# Altium project Sampler_ver.0.0.PrjPcb
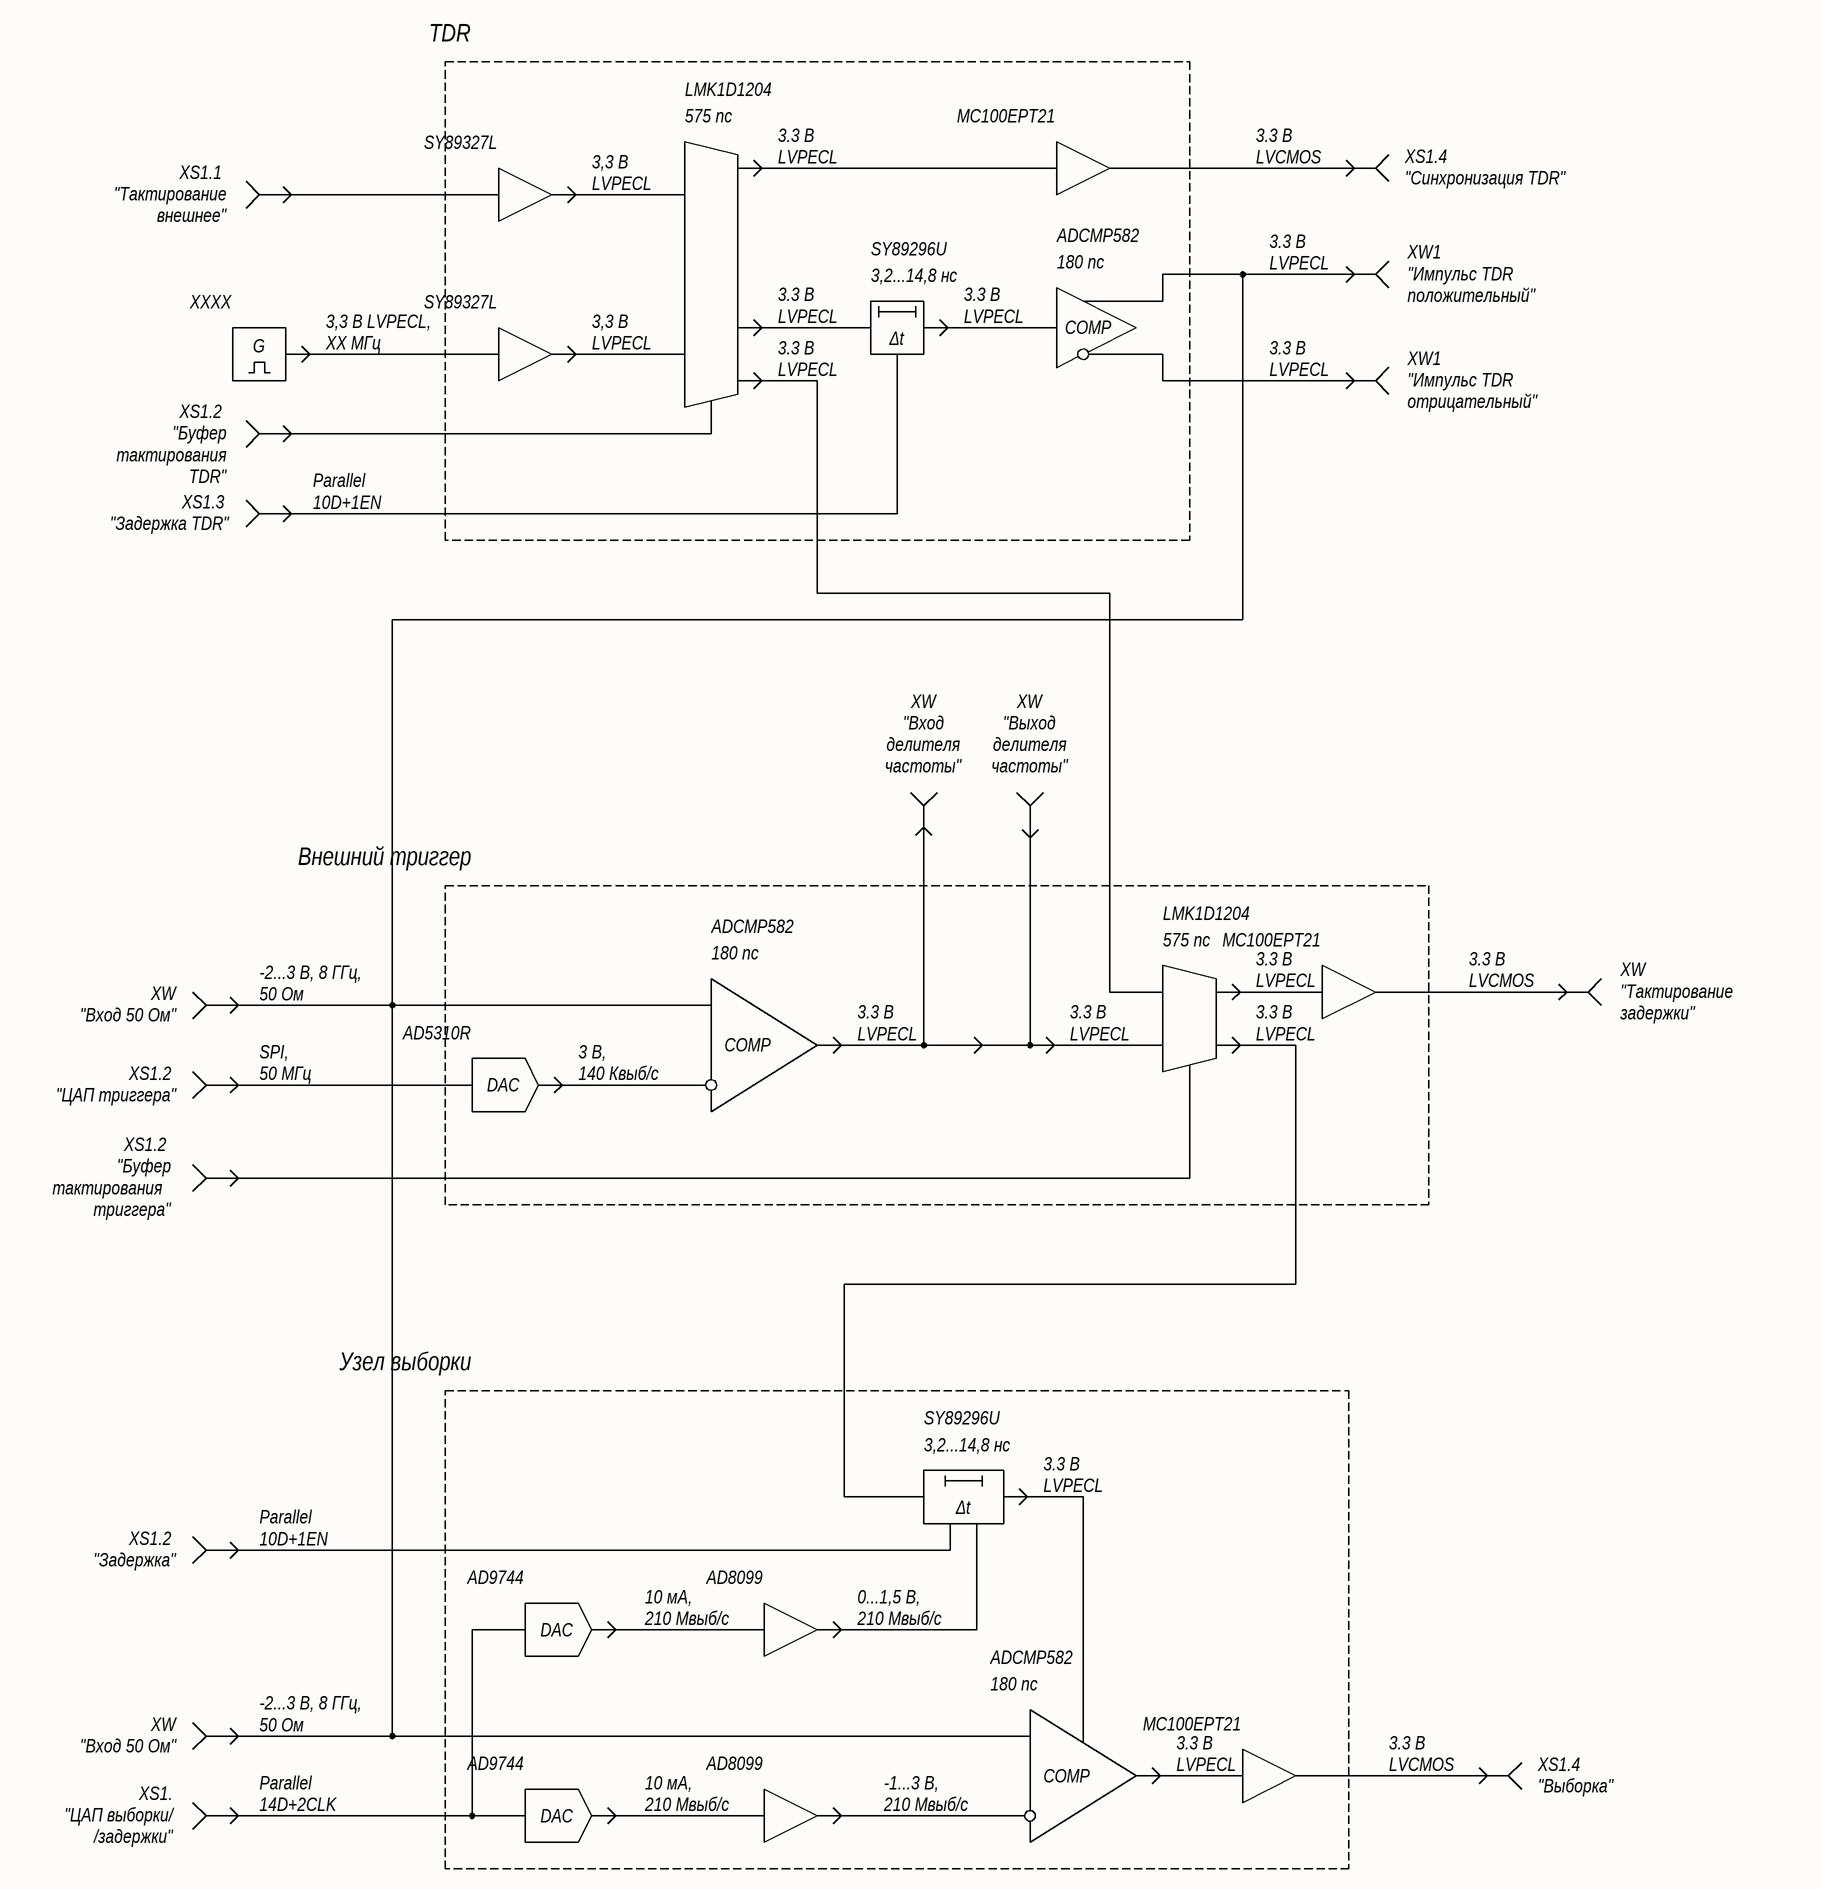
[diagram p0: Э2.SchDoc]
7 sheets, 253 parts. Net scope: global (net labels, ports and power ports of the same name join across sheets).
Board file: Sampler_ver.0.0.PcbDoc
Sheets:
  Э2.SchDoc
  Э3-1 УВ ЦАП.SchDoc
  Э3-2 УВ Компаратор.SchDoc
  Э3-3 Внешний триггер.SchDoc
  Э3-4 TDR Делитель.SchDoc
  Э3-5 TDR Генератор.SchDoc
  Э3-6 Электропитание.SchDoc

## Sheet Э2.SchDoc
size 594 x 420 mm; Address1: Address1; Address2: Address2; Address3: Address3; Address4: Address4; SheetNumber: 1; SheetTotal: 7; DocumentType: Схема электрическая принципиальная

### Notes on the sheet
- TDR
- LMK1D1204
- SY89327L
- 575 пс
- 3.3 В
  LVPECL
- MC100EPT21
- 3.3 В
  LVCMOS
- XS1.1
  "Тактирование
  внешнее"
- 3,3 В
  LVPECL
- ADCMP582
- XS1.4
  "Синхронизация TDR"
- XXXX
- 3,2...14,8 нс
- SY89296U
- 180 пс
- XW1
  "Импульс TDR
  положительный"
- G
- 3,3 В LVPECL,
  XX МГц
- Δt
- COMP
- XW1
  "Импульс TDR
  отрицательный"
- XS1.2
  "Буфер
  тактирования TDR"
- Parallel
  10D+1EN
- XS1.3
  "Задержка TDR"
- XW
  "Вход
  делителя
  частоты"
- XW
  "Выход
  делителя
  частоты"
- Внешний триггер
- XW
  "Вход 50 Ом"
- -2...3 В, 8 ГГц,
  50 Ом
- AD5310R
- XW
  "Тактирование
  задержки"
- XS1.2
  "ЦАП триггера"
- SPI,
  50 МГц
- DAC
- 3 В,
  140 Квыб/с
- XS1.2
  "Буфер
  тактирования
  триггера"
- Узел выборки
- XS1.2
  "Задержка"
- AD9744
- AD8099
- 10 мА,
  210 Мвыб/с
- 0...1,5 В,
  210 Мвыб/с
- XS1.4
  "Выборка"
- XS1.
  "ЦАП выборки/
  /задержки"
- Parallel
  14D+2CLK
- -1...3 В,
  210 Мвыб/с
- Перв. примен.
- Справ. №
- Подп. и дата
- Инв. № дубл.
- Взам. инв. №
- Разраб.
- Изм.
- Лист
- № докум.
- Подп.
- Дата
- Лит.
- Масса
- Масштаб
- Пров.
- Т.контр.
- Листов
- Инв. № подл.
- Утв.
- Н.контр.
- 2.106-A2
- Копировал
- Формат А2

## Sheet Э3-1 УВ ЦАП.SchDoc
size 594 x 420 mm; Address1: Address1; Address2: Address2; Address3: Address3; Address4: Address4; SheetNumber: 2; SheetTotal: 7; DocumentType: Схема электрическая принципиальная
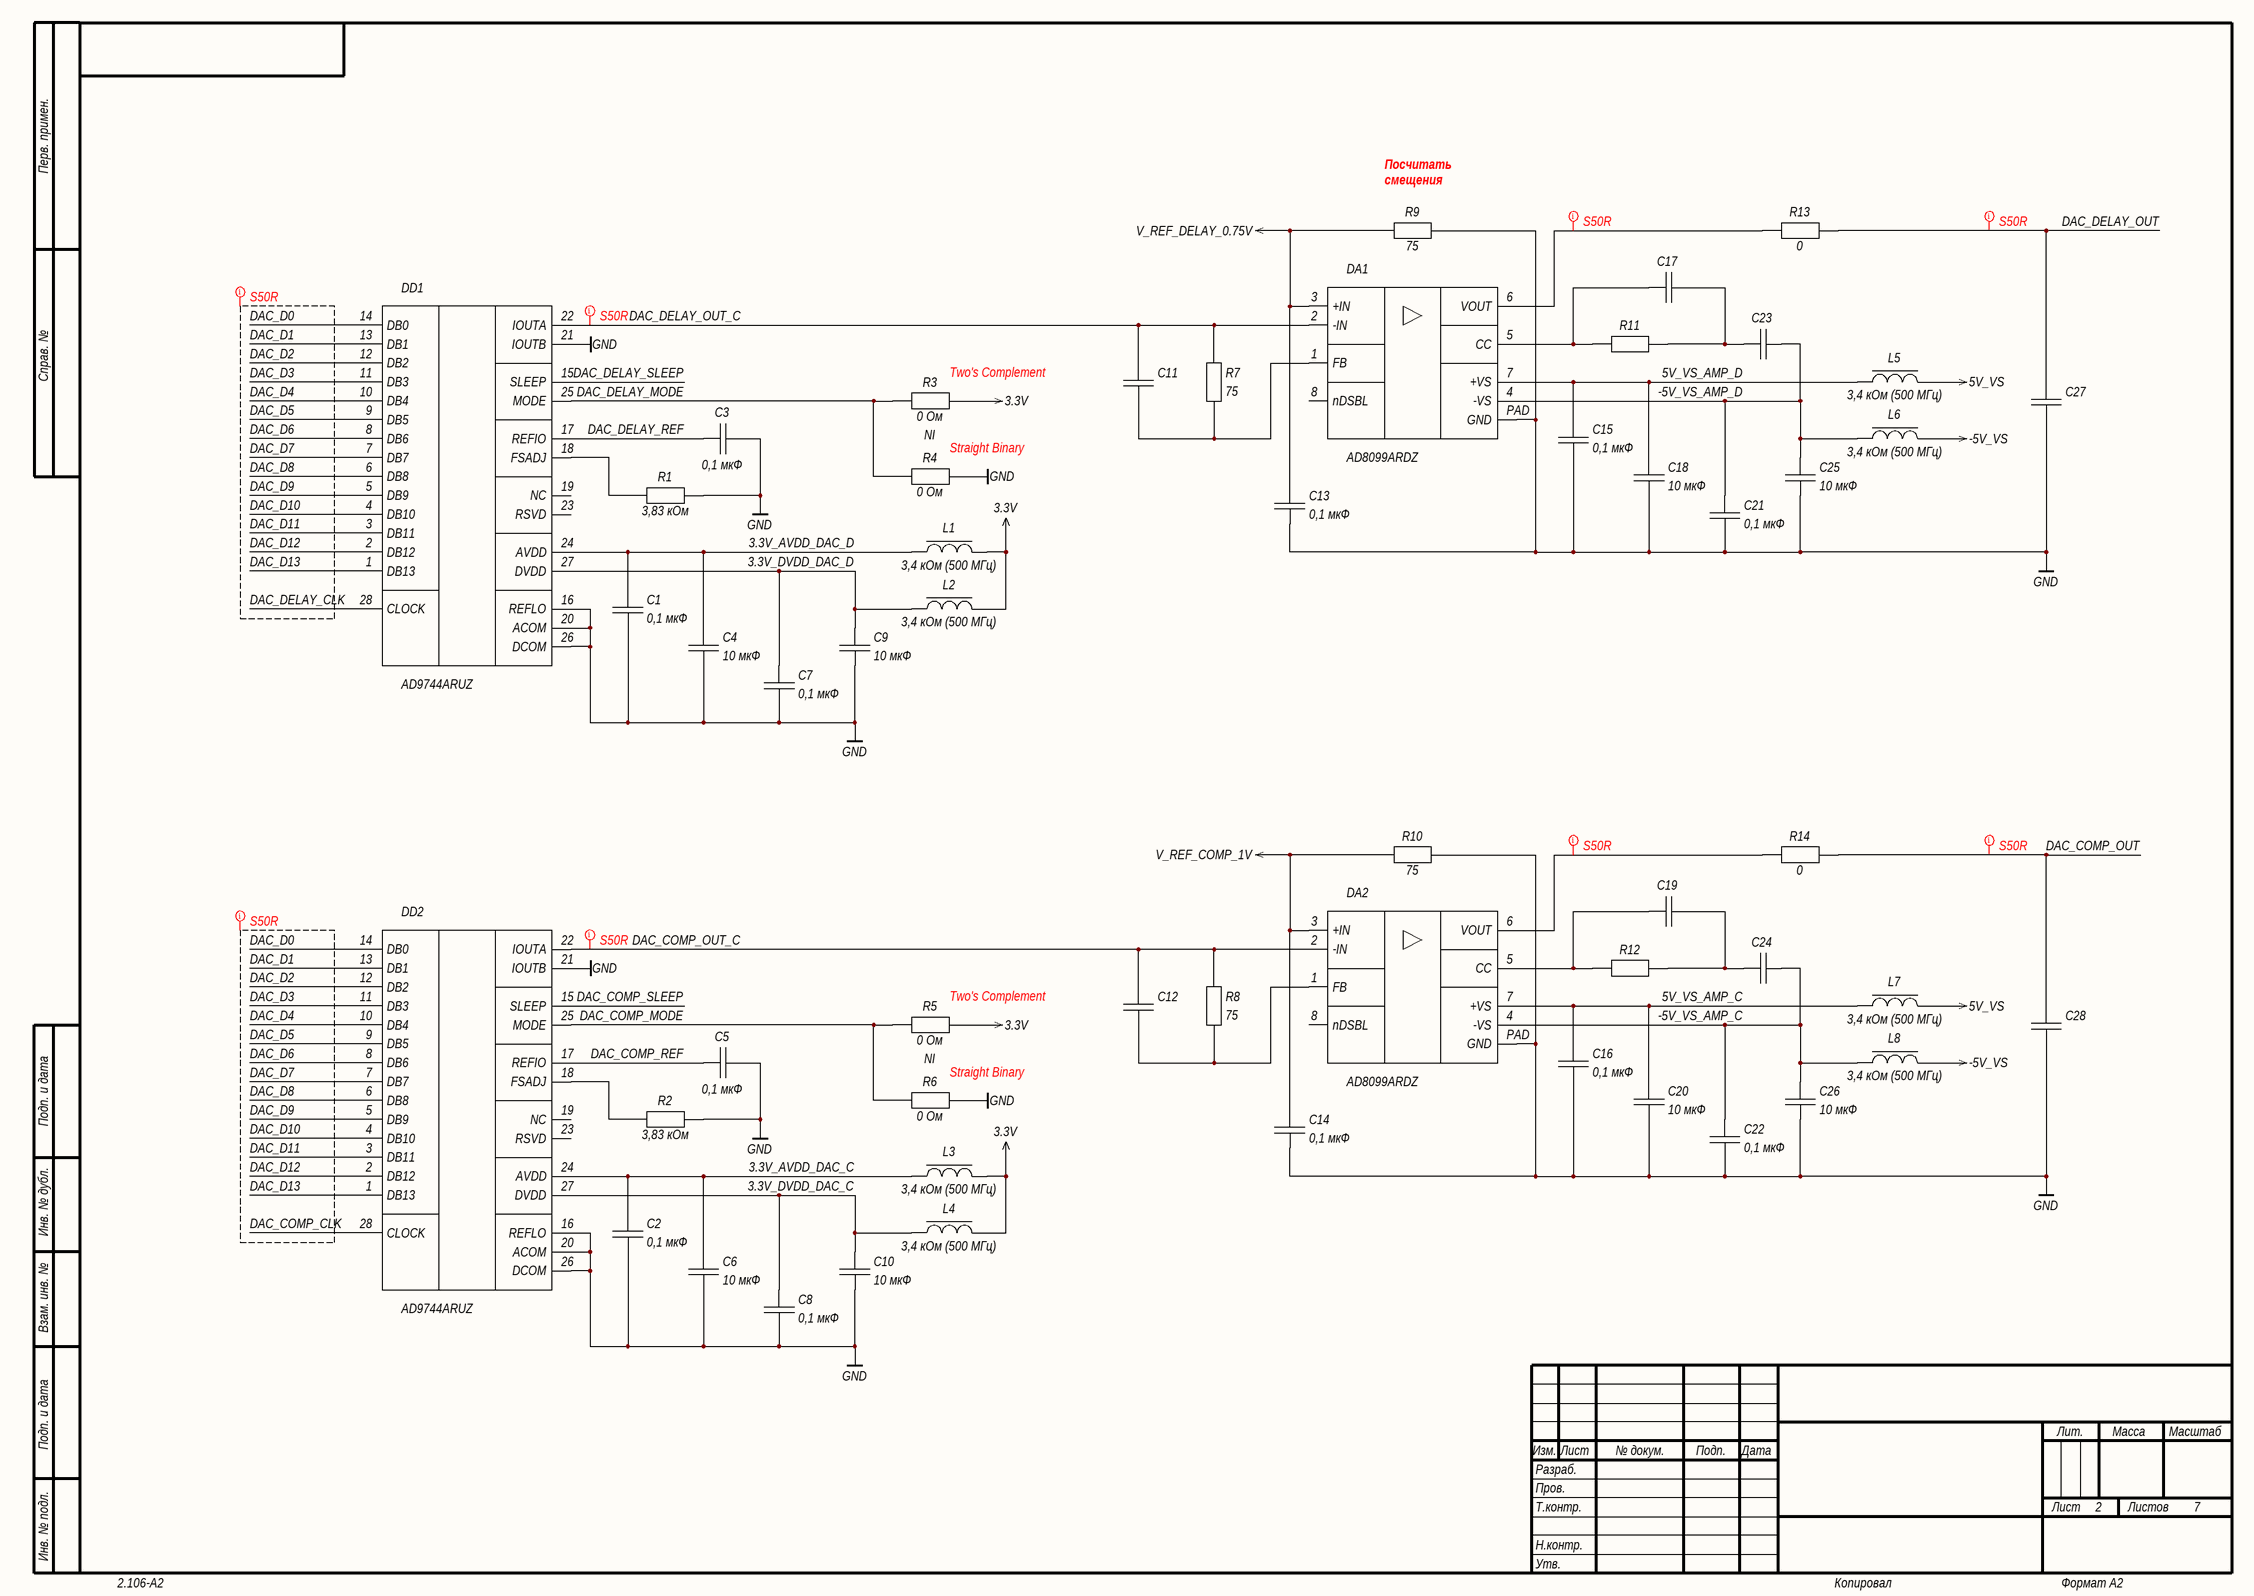
[diagram p1: Э3-1 УВ ЦАП.SchDoc]

### Parts
C1  value 0,1 мкФ  [C0402-B-0.5mm]
C2  value 0,1 мкФ  [C0402-B-0.5mm]
C3  value 0,1 мкФ  [C0402-B-0.5mm]
C4  value 10 мкФ  [C0603-B-0.8mm]
C5  value 0,1 мкФ  [C0402-B-0.5mm]
C6  value 10 мкФ  [C0603-B-0.8mm]
C7  value 0,1 мкФ  [C0402-B-0.5mm]
C8  value 0,1 мкФ  [C0402-B-0.5mm]
C9  value 10 мкФ  [C0603-B-0.8mm]
C10  value 10 мкФ  [C0603-B-0.8mm]
C11  (no value)  [C0402-B-0.5mm]
C12  (no value)  [C0402-B-0.5mm]
C13  value 0,1 мкФ  [C0402-B-0.5mm]
C14  value 0,1 мкФ  [C0402-B-0.5mm]
C15  value 0,1 мкФ  [C0402-B-0.5mm]
C16  value 0,1 мкФ  [C0402-B-0.5mm]
C17  (no value)  [C0402-B-0.5mm]
C18  value 10 мкФ  [C0603-B-0.8mm]
C19  (no value)  [C0402-B-0.5mm]
C20  value 10 мкФ  [C0603-B-0.8mm]
C21  value 0,1 мкФ  [C0402-B-0.5mm]
C22  value 0,1 мкФ  [C0402-B-0.5mm]
C23  (no value)  [C0402-B-0.5mm]
C24  (no value)  [C0402-B-0.5mm]
C25  value 10 мкФ  [C0603-B-0.8mm]
C26  value 10 мкФ  [C0603-B-0.8mm]
C27  (no value)  [C0402-B-0.5mm]
C28  (no value)  [C0402-B-0.5mm]
DA1  AD8099ARDZ  [8-SOIC-EP-3.9]
DA2  AD8099ARDZ  [8-SOIC-EP-3.9]
DD1  AD9744ARUZ  [28-TSSOP-4.4]
DD2  AD9744ARUZ  [28-TSSOP-4.4]
L1  value 3,4 кОм (500 МГц)  [L0402-B-0.5mm]
L2  value 3,4 кОм (500 МГц)  [L0402-B-0.5mm]
L3  value 3,4 кОм (500 МГц)  [L0402-B-0.5mm]
L4  value 3,4 кОм (500 МГц)  [L0402-B-0.5mm]
L5  value 3,4 кОм (500 МГц)  [L0402-B-0.5mm]
L6  value 3,4 кОм (500 МГц)  [L0402-B-0.5mm]
L7  value 3,4 кОм (500 МГц)  [L0402-B-0.5mm]
L8  value 3,4 кОм (500 МГц)  [L0402-B-0.5mm]
R1  value 3,83 кОм  [CR0402-B-0.35mm]
R2  value 3,83 кОм  [CR0402-B-0.35mm]
R3  value 0 Ом  ComponentType: NI  [CR0402-B-0.35mm]
R4  value 0 Ом  [CR0402-B-0.35mm]
R5  value 0 Ом  ComponentType: NI  [CR0402-B-0.35mm]
R6  value 0 Ом  [CR0402-B-0.35mm]
R7  value 75  [CR0402-B-0.35mm]
R8  value 75  [CR0402-B-0.35mm]
R9  value 75  [CR0402-B-0.35mm]
R10  value 75  [CR0402-B-0.35mm]
R11  (no value)  [CR0402-B-0.35mm]
R12  (no value)  [CR0402-B-0.35mm]
R13  value 0  [CR0402-B-0.35mm]
R14  value 0  [CR0402-B-0.35mm]

### Nets
3.3V: L1.2 L2.2 L3.2 L4.2 R3.2 R5.2
5V_VS: L5.2 L7.2
-5V_VS: L6.2 L8.2
GND: C1.2 C2.2 C3.2 C4.2 C5.2 C6.2 C7.2 C8.2 C9.2 C10.2 C13.2 C14.2 C15.2 C16.2 C18.2 C20.2 C21.2 C22.2 C25.2 C26.2 C27.2 C28.2 DA1.PAD(GND) DA2.PAD(GND) DD1.16(REFLO) DD1.20(ACOM) DD1.21(IOUTB) DD1.26(DCOM) DD2.16(REFLO) DD2.20(ACOM) DD2.21(IOUTB) DD2.26(DCOM) R1.2 R2.2 R4.2 R6.2 R9.2 R10.2
V_REF_COMP_1V: C14.1 DA2.3(+IN) R10.1
V_REF_DELAY_0.75V: C13.1 DA1.3(+IN) R9.1
3.3V_AVDD_DAC_C: C2.1 C6.1 DD2.24(AVDD) L3.1
3.3V_AVDD_DAC_D: C1.1 C4.1 DD1.24(AVDD) L1.1
3.3V_DVDD_DAC_C: C8.1 C10.1 DD2.27(DVDD) L4.1
3.3V_DVDD_DAC_D: C7.1 C9.1 DD1.27(DVDD) L2.1
5V_VS_AMP_C: C16.1 C20.1 DA2.7(+VS) L7.1
5V_VS_AMP_D: C15.1 C18.1 DA1.7(+VS) L5.1
-5V_VS_AMP_C: C22.1 C24.2 C26.1 DA2.4(-VS) L8.1
-5V_VS_AMP_D: C21.1 C23.2 C25.1 DA1.4(-VS) L6.1
DAC_COMP_CLK: DD2.28(CLOCK)
DAC_COMP_MODE: DD2.25(MODE) R5.1 R6.1
DAC_COMP_OUT: C28.1 R14.2
DAC_COMP_OUT_C: C12.1 DA2.2(-IN) DD2.22(IOUTA) R8.1
DAC_COMP_REF: C5.1 DD2.17(REFIO)
DAC_COMP_SLEEP: DD2.15(SLEEP)
DAC_D0: DD1.14(DB0) DD2.14(DB0)
DAC_D1: DD1.13(DB1) DD2.13(DB1)
DAC_D2: DD1.12(DB2) DD2.12(DB2)
DAC_D3: DD1.11(DB3) DD2.11(DB3)
DAC_D4: DD1.10(DB4) DD2.10(DB4)
DAC_D5: DD1.9(DB5) DD2.9(DB5)
DAC_D6: DD1.8(DB6) DD2.8(DB6)
DAC_D7: DD1.7(DB7) DD2.7(DB7)
DAC_D8: DD1.6(DB8) DD2.6(DB8)
DAC_D9: DD1.5(DB9) DD2.5(DB9)
DAC_D10: DD1.4(DB10) DD2.4(DB10)
DAC_D11: DD1.3(DB11) DD2.3(DB11)
DAC_D12: DD1.2(DB12) DD2.2(DB12)
DAC_D13: DD1.1(DB13) DD2.1(DB13)
DAC_DELAY_CLK: DD1.28(CLOCK)
DAC_DELAY_MODE: DD1.25(MODE) R3.1 R4.1
DAC_DELAY_OUT: C27.1 R13.2
DAC_DELAY_OUT_C: C11.1 DA1.2(-IN) DD1.22(IOUTA) R7.1
DAC_DELAY_REF: C3.1 DD1.17(REFIO)
DAC_DELAY_SLEEP: DD1.15(SLEEP)
NetC11_2: C11.2 DA1.1(FB) R7.2
NetC12_2: C12.2 DA2.1(FB) R8.2
NetC17_1: C17.1 DA1.5(CC) R11.1
NetC17_2: C17.2 C23.1 R11.2
NetC19_1: C19.1 DA2.5(CC) R12.1
NetC19_2: C19.2 C24.1 R12.2
NetDA1_6: DA1.6(VOUT) R13.1
NetDA2_6: DA2.6(VOUT) R14.1
NetDD1_18: DD1.18(FSADJ) R1.1
NetDD2_18: DD2.18(FSADJ) R2.1

Not connected (* = marked no-connect by the designer): DA1 8(nDSBL); DA2 8(nDSBL); DD1 19(NC) 23(RSVD); DD2 19(NC) 23(RSVD)

### Layout directives
net class S50R: DAC_COMP_CLK, DAC_COMP_OUT, DAC_COMP_OUT_C, DAC_D0, DAC_D1, DAC_D2, DAC_D3, DAC_D4, DAC_D5, DAC_D6, DAC_D7, DAC_D8, DAC_D9, DAC_D10, DAC_D11, DAC_D12, DAC_D13, DAC_DELAY_CLK, DAC_DELAY_OUT, DAC_DELAY_OUT_C, NetDA1_6, NetDA2_6

### Notes on the sheet
- (near R9) Посчитать смещения
- (near R3) Two's Complement
- (near R4) Straight Binary
- (near R5) Two's Complement
- (near R6) Straight Binary
- Перв. примен.
- Справ. №
- Подп. и дата
- Инв. № дубл.
- Взам. инв. №
- Разраб.
- Изм.
- Лист
- № докум.
- Подп.
- Дата
- Лит.
- Масса
- Масштаб
- Пров.
- Т.контр.
- Листов
- Инв. № подл.
- Утв.
- Н.контр.
- 2.106-A2
- Копировал
- Формат А2

### Library data of the parts
C1 C2 C7 C8 C13-C16 C21 C22 = Non Polar Ver.: 0402 X7R 0,1 мкФ ±10 % 50 В; PartNumber: GRM155R71H104KE14D; TemperatureRange: -XX...+XX°C; VoltageRating: 50 В; Manufacturer: *; Package: *; HelpURL: *; Tolerance: *; TypeDielectric: *; ESR: *; ComponentType: CAP
C3 C5 = Non Polar Hor.: 0402 X7R 0,1 мкФ ±10 % 50 В; PartNumber: GRM155R71H104KE14D; TemperatureRange: -XX...+XX°C; VoltageRating: 50 В; Manufacturer: *; Package: *; HelpURL: *; Tolerance: *; TypeDielectric: *; ESR: *; ComponentType: CAP
C4 C6 C9 C18 C20 C25 C26 = Non Polar Ver.: 0603 X5R 10 мкФ ±20 % 25 В; PartNumber: GRM188R61E106MA73; TemperatureRange: -XX...+XX°C; VoltageRating: 25 В; Manufacturer: *; Package: *; HelpURL: *; Tolerance: *; TypeDielectric: *; ESR: *; ComponentType: CAP
C10 = Non Polar Ver.: GRM188R61E106MA73; TemperatureRange: -XX...+XX°C; VoltageRating: 25 В; Manufacturer: *; PartNumber: GRM188R61E106MA73; Package: *; HelpURL: *; Tolerance: *; TypeDielectric: *; ESR: *; ComponentType: CAP
C11 C12 C27 C28 = Non Polar Ver.: TemperatureRange: -XX...+XX°C; Manufacturer: *; PartNumber: *; Package: *; HelpURL: *; Tolerance: *; TypeDielectric: *; ESR: *; ComponentType: CAP; VoltageRating: *
C17 C19 C23 C24 = Non Polar Hor.: TemperatureRange: -XX...+XX°C; Manufacturer: *; Package: *; HelpURL: *; Tolerance: *; TypeDielectric: *; ESR: *; ComponentType: CAP
DA1 DA2 = AD8099ARDZ: Ultralow Distortion, High Speed, 0.95 nV/√Hz Voltage Noise Op Amp; Manufacturer: Analog Devices, Inc.; TemperatureRange: -40...+125°C; Package: 8-SOIC-EP; PartNumber: AD8099ARDZ; ComponentType: IC; DatasheetURL: *; HelpURL: *; PinCount: 8
DD1 DD2 = AD9744ARUZ: 14-Bit, 210 MSPS TxDAC® / D/A Converter; Manufacturer: Analog Devices; TemperatureRange: -40...+85°C; Package: 28-TSSOP; PartNumber: AD9744ARUZ; ComponentType: IC; DatasheetURL: *; HelpURL: *; PinCount: 8
L1-L8 = Inductor MC Hor.: PartNumber: BLM15HD182BH1; TemperatureRange: -XX...+XX°C; Manufacturer: *; Package: *; HelpURL: *; MaxCurrent: *; ComponentType: IND; DatasheetURL: *; PinCount: 2
R1 R2 = Resistor Hor.: 0402 3,83 кОм ±1 %; TemperatureRange: -XX...+XX°C; Manufacturer: *; PartNumber: *; Package: *; HelpURL: *; PowerRating: *; Tolerance: *; DatasheetURL: *; ComponentType: RES
R3 R5 R13 R14 = Resistor Hor.: 0402 0 Ом; TemperatureRange: -XX...+XX°C; Manufacturer: *; PartNumber: *; Package: *; HelpURL: *; PowerRating: *; Tolerance: *; DatasheetURL: *
  R13 R14: ComponentType: RES
R4 R6 R11 R12 = Resistor Hor.: TemperatureRange: -XX...+XX°C; Manufacturer: *; PartNumber: *; Package: *; HelpURL: *; PowerRating: *; Tolerance: *; DatasheetURL: *; ComponentType: RES
R7 R8 = Resistor Ver.: 0402 75 Ом ±1 %; TemperatureRange: -XX...+XX°C; Manufacturer: *; PartNumber: *; Package: *; HelpURL: *; PowerRating: *; DatasheetURL: *; Tolerance: *; ComponentType: RES
R9 R10 = Resistor Hor.: 0402 75 Ом ±1 %; TemperatureRange: -XX...+XX°C; Manufacturer: *; PartNumber: *; Package: *; HelpURL: *; PowerRating: *; Tolerance: *; DatasheetURL: *; ComponentType: RES

## Sheet Э3-2 УВ Компаратор.SchDoc
size 594 x 420 mm; Address1: Address1; Address2: Address2; Address3: Address3; Address4: Address4; DocumentNumber: АБВГ.123456.001 Э3; SheetNumber: 3; SheetTotal: 7; Scale: 1:1; DocumentType: Схема электрическая принципиальная; FirstReferrence: АБВГ.123456.001
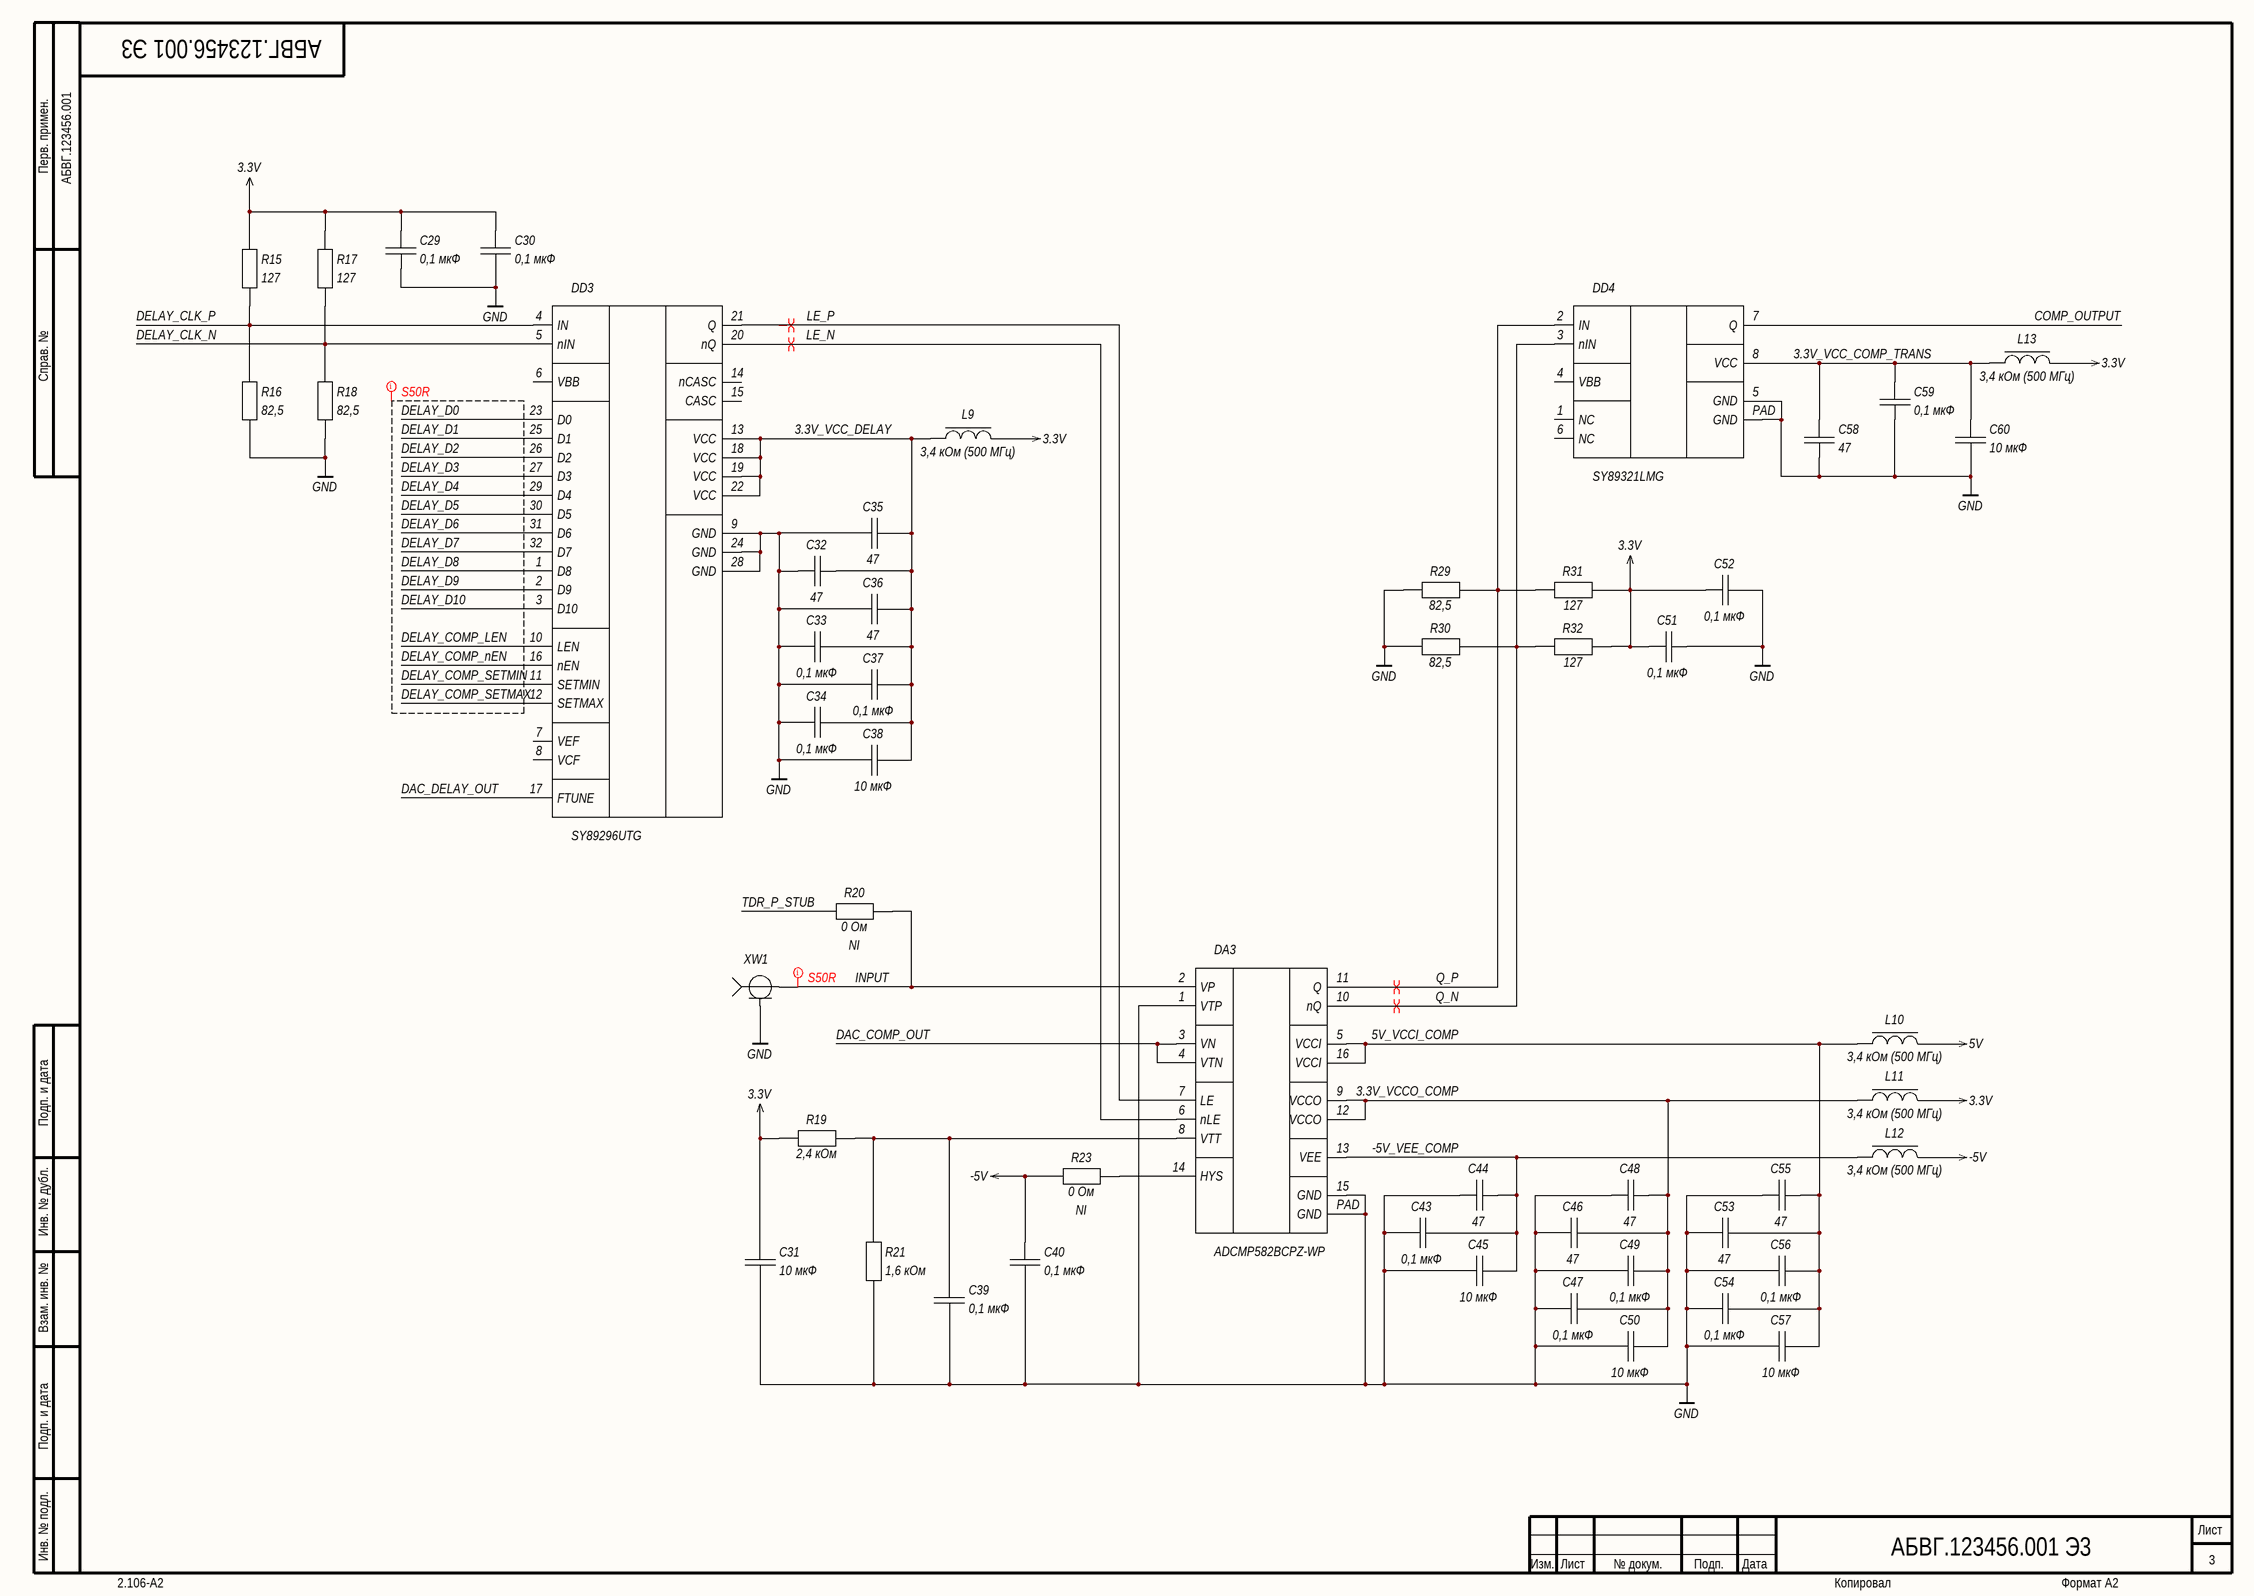
[diagram p2: Э3-2 УВ Компаратор.SchDoc]

### Parts
C29  value 0,1 мкФ  [C0402-B-0.5mm]
C30  value 0,1 мкФ  [C0402-B-0.5mm]
C31  value 10 мкФ  [C0603-B-0.8mm]
C32  value 47  [C0402-B-0.5mm]
C33  value 0,1 мкФ  [C0402-B-0.5mm]
C34  value 0,1 мкФ  [C0402-B-0.5mm]
C35  value 47  [C0402-B-0.5mm]
C36  value 47  [C0402-B-0.5mm]
C37  value 0,1 мкФ  [C0402-B-0.5mm]
C38  value 10 мкФ  [C0603-B-0.8mm]
C39  value 0,1 мкФ  [C0402-B-0.5mm]
C40  value 0,1 мкФ  [C0402-B-0.5mm]
C43  value 0,1 мкФ  [C0402-B-0.5mm]
C44  value 47  [C0402-B-0.5mm]
C45  value 10 мкФ  [C0603-B-0.8mm]
C46  value 47  [C0402-B-0.5mm]
C47  value 0,1 мкФ  [C0402-B-0.5mm]
C48  value 47  [C0402-B-0.5mm]
C49  value 0,1 мкФ  [C0402-B-0.5mm]
C50  value 10 мкФ  [C0603-B-0.8mm]
C51  value 0,1 мкФ  [C0402-B-0.5mm]
C52  value 0,1 мкФ  [C0402-B-0.5mm]
C53  value 47  [C0402-B-0.5mm]
C54  value 0,1 мкФ  [C0402-B-0.5mm]
C55  value 47  [C0402-B-0.5mm]
C56  value 0,1 мкФ  [C0402-B-0.5mm]
C57  value 10 мкФ  [C0603-B-0.8mm]
C58  value 47  [C0402-B-0.5mm]
C59  value 0,1 мкФ  [C0402-B-0.5mm]
C60  value 10 мкФ  [C0603-B-0.8mm]
DA3  ADCMP582BCPZ-WP  [16-LFCSP-3-H0.75]
DD3  SY89296UTG  [32-TQFP-B]
DD4  SY89321LMG  [8-MLF]
L9  value 3,4 кОм (500 МГц)  [L0402-B-0.5mm]
L10  value 3,4 кОм (500 МГц)  [L0402-B-0.5mm]
L11  value 3,4 кОм (500 МГц)  [L0402-B-0.5mm]
L12  value 3,4 кОм (500 МГц)  [L0402-B-0.5mm]
L13  value 3,4 кОм (500 МГц)  [L0402-B-0.5mm]
R15  value 127  [CR0402-B-0.35mm]
R16  value 82,5  [CR0402-B-0.35mm]
R17  value 127  [CR0402-B-0.35mm]
R18  value 82,5  [CR0402-B-0.35mm]
R19  value 2,4 кОм  [CR0402-B-0.35mm]
R20  value 0 Ом  ComponentType: NI  [CR0402-B-0.35mm]
R21  value 1,6 кОм  [CR0402-B-0.35mm]
R23  value 0 Ом  ComponentType: NI  [CR0402-B-0.35mm]
R29  value 82,5  [CR0402-B-0.35mm]
R30  value 82,5  [CR0402-B-0.35mm]
R31  value 127  [CR0402-B-0.35mm]
R32  value 127  [CR0402-B-0.35mm]
XW1  XW(S)  [SMA-J-P-H-ST-EM1]  (value not drawn)

### Nets
3.3V: C29.1 C30.1 C31.1 C51.1 C52.1 L9.2 L11.2 L13.2 R15.1 R17.1 R19.1 R31.2 R32.2
5V: L10.2
-5V: C40.1 L12.2 R23.1
GND: C29.2 C30.2 C31.2 C32.1 C33.1 C34.1 C35.1 C36.1 C37.1 C38.1 C39.2 C40.2 C43.1 C44.1 C45.1 C46.1 C47.1 C48.1 C49.1 C50.1 C51.2 C52.2 C53.1 C54.1 C55.1 C56.1 C57.1 C58.2 C59.2 C60.2 DA3.1(VTP) DA3.15(GND) DA3.PAD(GND) DD3.9(GND) DD3.24(GND) DD3.28(GND) DD4.5(GND) DD4.PAD(GND) R16.2 R18.2 R21.2 R29.1 R30.1 XW1.2
3.3V_VCC_COMP_TRANS: C58.1 C59.1 C60.1 DD4.8(VCC) L13.1
3.3V_VCC_DELAY: C32.2 C33.2 C34.2 C35.2 C36.2 C37.2 C38.2 DD3.13(VCC) DD3.18(VCC) DD3.19(VCC) DD3.22(VCC) L9.1
3.3V_VCCO_COMP: C46.2 C47.2 C48.2 C49.2 C50.2 DA3.9(VCCO) DA3.12(VCCO) L11.1
5V_VCCI_COMP: C53.2 C54.2 C55.2 C56.2 C57.2 DA3.5(VCCI) DA3.16(VCCI) L10.1
-5V_VEE_COMP: C43.2 C44.2 C45.2 DA3.13(VEE) L12.1
COMP_OUTPUT: DD4.7(Q)
DAC_COMP_OUT: DA3.3(VN) DA3.4(VTN)
DAC_DELAY_OUT: DD3.17(FTUNE)
DELAY_CLK_N: DD3.5(nIN) R17.2 R18.1
DELAY_CLK_P: DD3.4(IN) R15.2 R16.1
DELAY_COMP_LEN: DD3.10(LEN)
DELAY_COMP_nEN: DD3.16(nEN)
DELAY_COMP_SETMAX: DD3.12(SETMAX)
DELAY_COMP_SETMIN: DD3.11(SETMIN)
DELAY_D0: DD3.23(D0)
DELAY_D1: DD3.25(D1)
DELAY_D2: DD3.26(D2)
DELAY_D3: DD3.27(D3)
DELAY_D4: DD3.29(D4)
DELAY_D5: DD3.30(D5)
DELAY_D6: DD3.31(D6)
DELAY_D7: DD3.32(D7)
DELAY_D8: DD3.1(D8)
DELAY_D9: DD3.2(D9)
DELAY_D10: DD3.3(D10)
INPUT: DA3.2(VP) R20.1 XW1.1
LE_N: DA3.6(nLE) DD3.20(nQ)
LE_P: DA3.7(LE) DD3.21(Q)
Q_N: DA3.10(nQ) DD4.3(nIN) R30.2 R32.1
Q_P: DA3.11(Q) DD4.2(IN) R29.2 R31.1
TDR_P_STUB: R20.2
NetC39_1: C39.1 DA3.8(VTT) R19.2 R21.1
NetDA3_14: DA3.14(HYS) R23.2

Not connected (* = marked no-connect by the designer): DD3 6(VBB) 7(VEF) 8(VCF) 14(nCASC) 15(CASC); DD4 1(NC) 4(VBB) 6(NC)

### Layout directives
differential pair: LE_N, LE_P, Q_N, Q_P
net class S50R: DELAY_COMP_LEN, DELAY_COMP_nEN, DELAY_COMP_SETMAX, DELAY_COMP_SETMIN, DELAY_D0, DELAY_D1, DELAY_D2, DELAY_D3, DELAY_D4, DELAY_D5, DELAY_D6, DELAY_D7, DELAY_D8, DELAY_D9, DELAY_D10, INPUT

### Notes on the sheet
- Перв. примен.
- Справ. №
- Подп. и дата
- Инв. № дубл.
- Взам. инв. №
- Инв. № подл.
- Изм.
- Лист
- № докум.
- Подп.
- Дата
- 2.106-A2
- Копировал
- Формат А2

### Library data of the parts
C29 C30 C39 C40 C59 = Non Polar Ver.: as C1 on sheet Э3-1 УВ ЦАП; Manufacturer: *; Package: *; HelpURL: *; Tolerance: *; TypeDielectric: *; ESR: *; ComponentType: CAP
C31 C60 = Non Polar Ver.: as C4 on sheet Э3-1 УВ ЦАП; Manufacturer: *; Package: *; HelpURL: *; Tolerance: *; TypeDielectric: *; ESR: *; ComponentType: CAP
C32 C35 C36 C44 C46 C48 C53 C55 = Non Polar Hor.: 0402 NP0 47 пФ ±5 % 50 В; PartNumber: GCM1555C1H470JA16; TemperatureRange: -XX...+XX°C; VoltageRating: 50 В; Manufacturer: *; Package: *; HelpURL: *; Tolerance: *; TypeDielectric: *; ESR: *; ComponentType: CAP
C33 C34 C37 C43 C47 C49 C51 C52 C54 C56 = Non Polar Hor.: as C3 on sheet Э3-1 УВ ЦАП; Manufacturer: *; Package: *; HelpURL: *; Tolerance: *; TypeDielectric: *; ESR: *; ComponentType: CAP
C38 C45 C50 C57 = Non Polar Hor.: 0603 X5R 10 мкФ ±20 % 25 В; PartNumber: GRM188R61E106MA73; TemperatureRange: -XX...+XX°C; VoltageRating: 25 В; Manufacturer: *; Package: *; HelpURL: *; Tolerance: *; TypeDielectric: *; ESR: *; ComponentType: CAP
C58 = Non Polar Ver.: 0402 NP0 47 пФ ±5 % 50 В; PartNumber: GCM1555C1H470JA16; TemperatureRange: -XX...+XX°C; VoltageRating: 50 В; Manufacturer: *; Package: *; HelpURL: *; Tolerance: *; TypeDielectric: *; ESR: *; ComponentType: CAP
DA3 = ADCMP582: Ultrafast SiGe Voltage Comparators; Manufacturer: Analog Devices, Inc.; TemperatureRange: -40...+125°C; Package: 16-LFCSP; PartNumber: ADCMP582BCPZ-WP; ComponentType: IC; DatasheetURL: *; HelpURL: *; PinCount: 16
DD3 = SY89296UTG: 2.5V/3.3V, 1.5 GHz, LVPECL Programmable Delay with Fine Tune Control; Manufacturer: Microchip; TemperatureRange: -40...+85°C; Package: 32-TQFP; DatasheetURL: *; HelpURL: *; PinCount: 32; PartNumber: SY89296UTG; ComponentType: IC
DD4 = SY89321L: 3.3V DIFFERENTIAL LVPECL/CML/LVDS-to-LVTTL TRANSLATOR; Manufacturer: Microchip Technology; TemperatureRange: -40...+85°C; Package: 8-MLF; PartNumber: SY89321LMG; ComponentType: IC; DatasheetURL: *; HelpURL: *; PinCount: 8
L9-L13 = Inductor MC Hor.: as L1 on sheet Э3-1 УВ ЦАП; Manufacturer: *; Package: *; HelpURL: *; MaxCurrent: *; ComponentType: IND; DatasheetURL: *; PinCount: 2
R15 R17 = Resistor Ver.: 0402 127 Ом ±1 %; TemperatureRange: -XX...+XX°C; Manufacturer: *; PartNumber: *; Package: *; HelpURL: *; PowerRating: *; DatasheetURL: *; Tolerance: *; ComponentType: RES
R16 R18 = Resistor Ver.: 0402 82,5 Ом ±1 %; TemperatureRange: -XX...+XX°C; Manufacturer: *; PartNumber: *; Package: *; HelpURL: *; PowerRating: *; DatasheetURL: *; Tolerance: *; ComponentType: RES
R19 = Resistor Hor.: 0402 2,4 кОм ±1 %; TemperatureRange: -XX...+XX°C; Manufacturer: *; PartNumber: *; Package: *; HelpURL: *; PowerRating: *; Tolerance: *; DatasheetURL: *; ComponentType: RES
R20 R23 = Resistor Hor.: 0402 0 Ом; TemperatureRange: -XX...+XX°C; Manufacturer: *; PartNumber: *; Package: *; HelpURL: *; PowerRating: *; Tolerance: *; DatasheetURL: *
R21 = Resistor Ver.: 0402 1,6 кОм ±1 %; TemperatureRange: -XX...+XX°C; Manufacturer: *; PartNumber: *; Package: *; HelpURL: *; PowerRating: *; DatasheetURL: *; Tolerance: *; ComponentType: RES
R29 R30 = Resistor Hor.: 0402 82,5 Ом ±1 %; TemperatureRange: -XX...+XX°C; Manufacturer: *; PartNumber: *; Package: *; HelpURL: *; PowerRating: *; Tolerance: *; DatasheetURL: *; ComponentType: RES
R31 R32 = Resistor Hor.: 0402 127 Ом ±1 %; TemperatureRange: -XX...+XX°C; Manufacturer: *; PartNumber: *; Package: *; HelpURL: *; PowerRating: *; Tolerance: *; DatasheetURL: *; ComponentType: RES
XW1 = XW(S): TemperatureRange: -XX...+XX°C; Manufacturer: *; Package: *; HelpURL: *; DatasheetURL: *; PartNumber: *; PinCount: 2; ComponentType: Connector

## Sheet Э3-3 Внешний триггер.SchDoc
size 594 x 420 mm; Address1: Address1; Address2: Address2; Address3: Address3; Address4: Address4; DocumentNumber: АБВГ.123456.001 Э3; SheetNumber: 4; SheetTotal: 7; Scale: 1:1; DocumentType: Схема электрическая принципиальная; FirstReferrence: АБВГ.123456.001
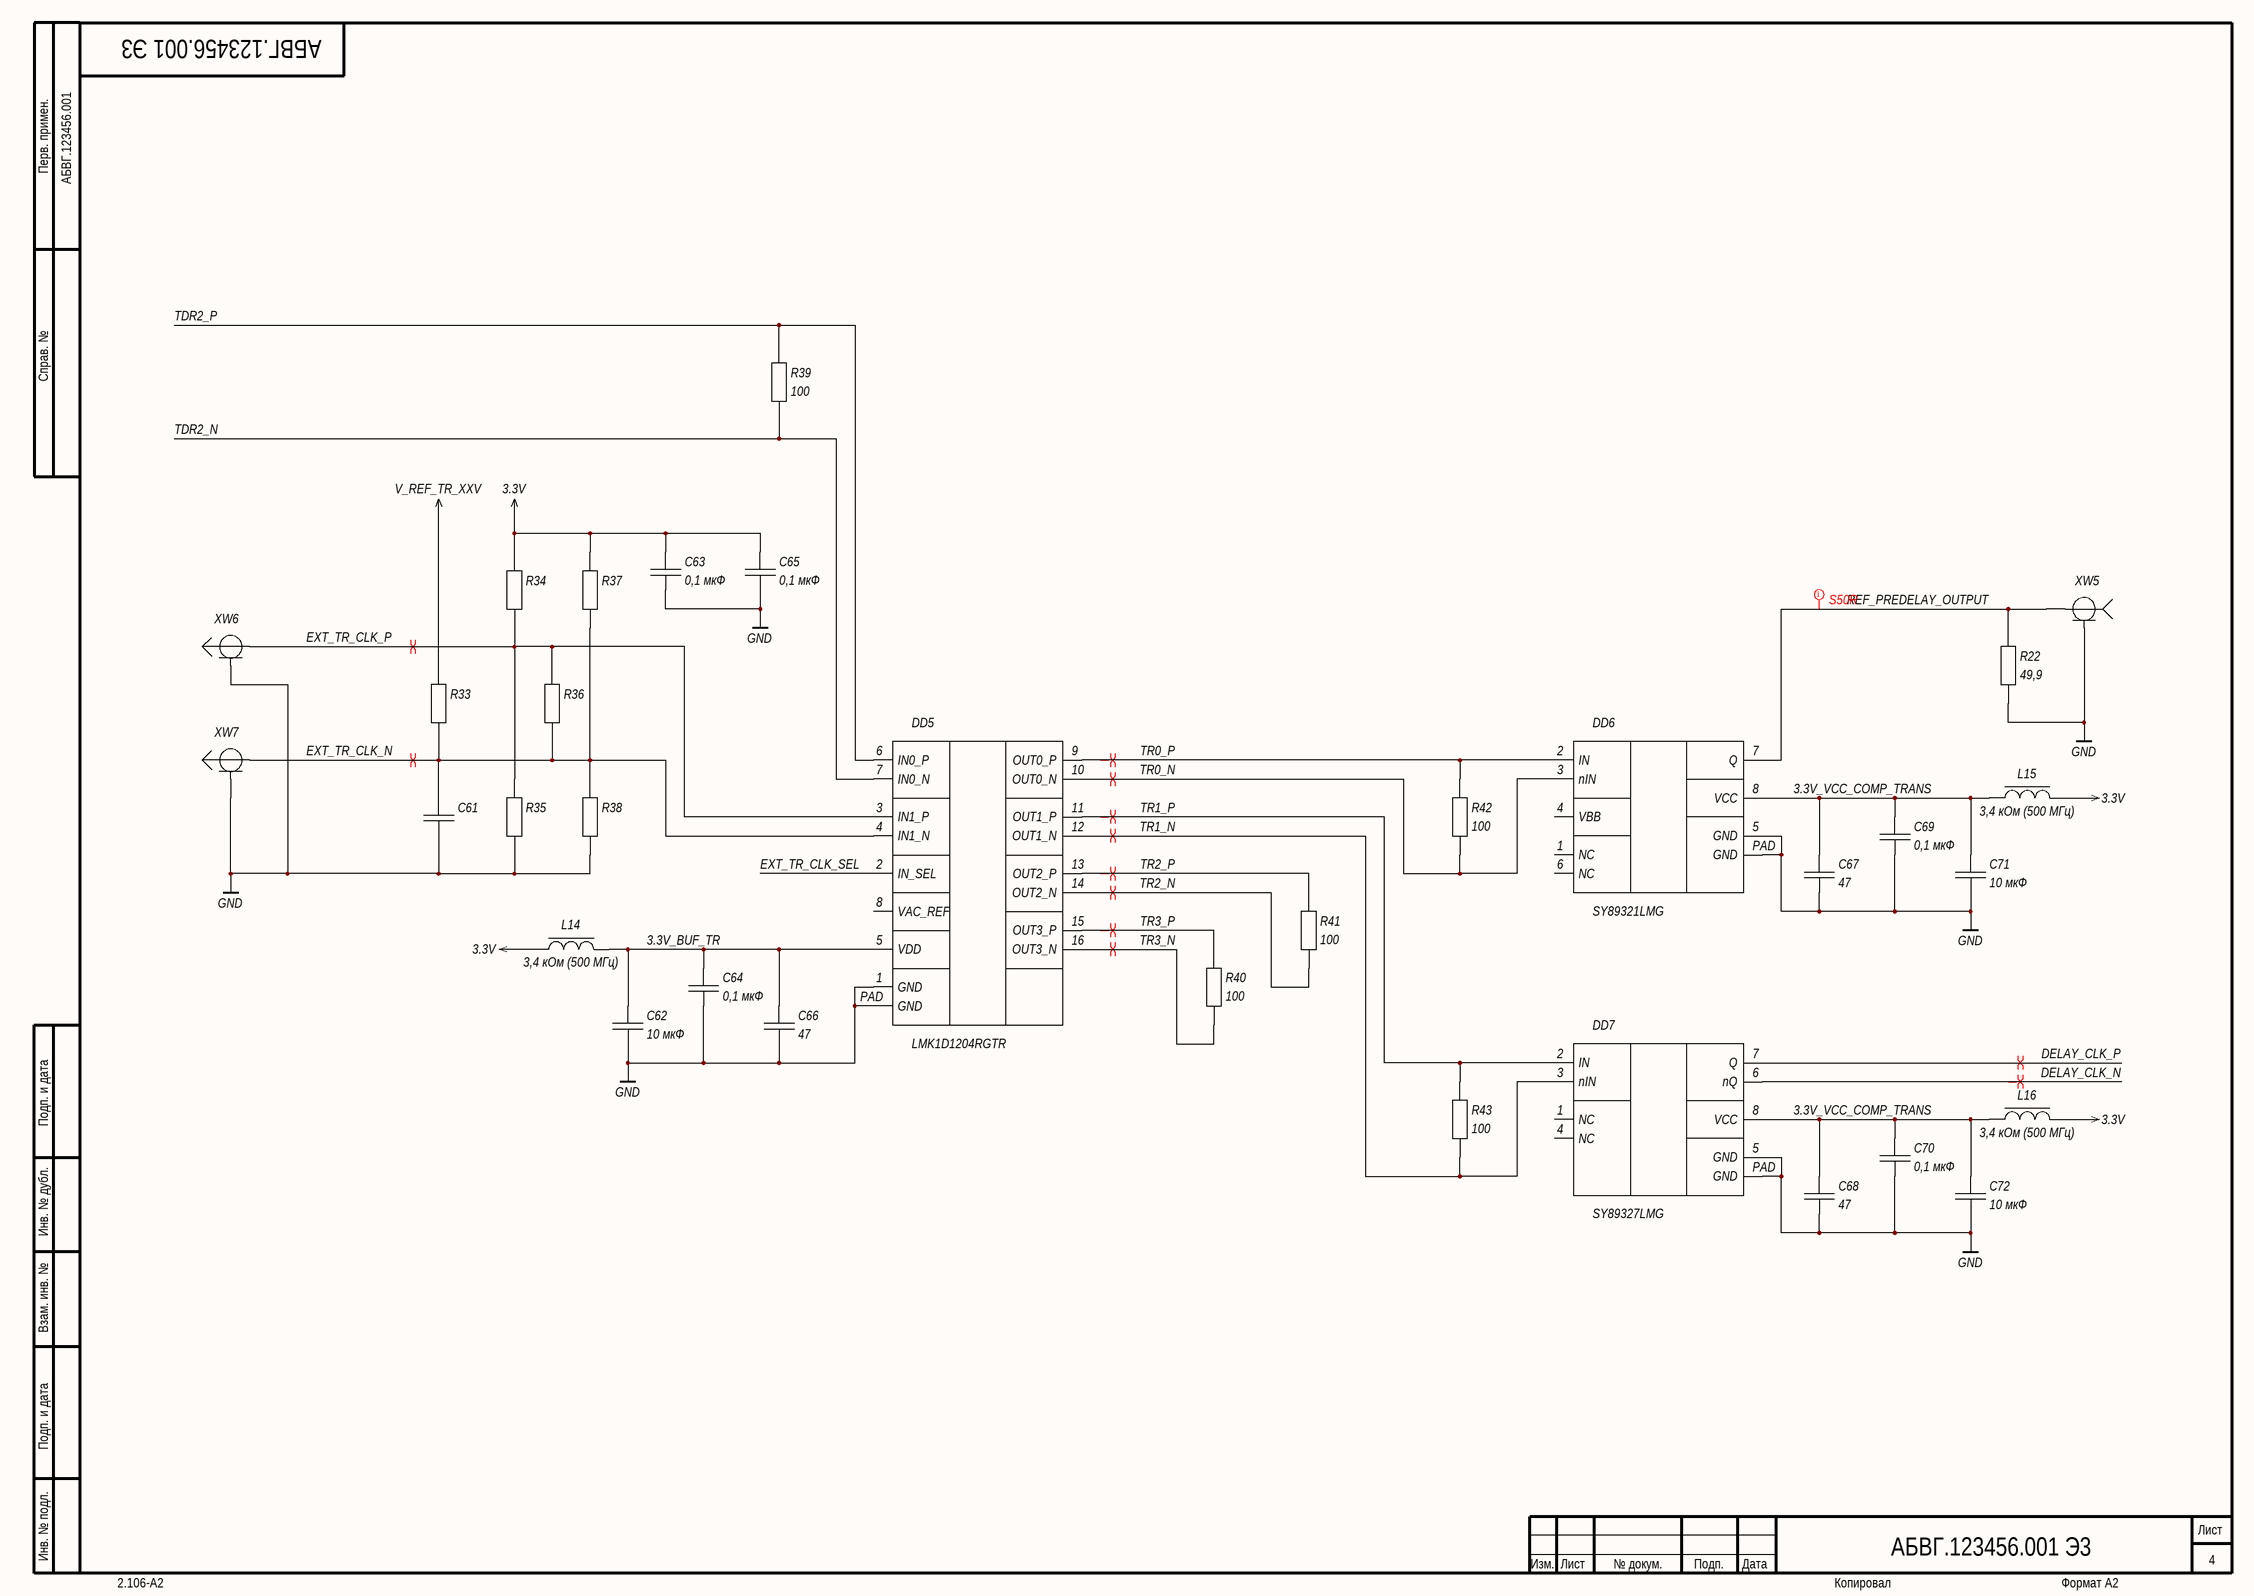
[diagram p3: Э3-3 Внешний триггер.SchDoc]

### Parts
C61  (no value)  [C0402-B-0.5mm]
C62  value 10 мкФ  [C0603-B-0.8mm]
C63  value 0,1 мкФ  [C0402-B-0.5mm]
C64  value 0,1 мкФ  [C0402-B-0.5mm]
C65  value 0,1 мкФ  [C0402-B-0.5mm]
C66  value 47  [C0402-B-0.5mm]
C67  value 47  [C0402-B-0.5mm]
C68  value 47  [C0402-B-0.5mm]
C69  value 0,1 мкФ  [C0402-B-0.5mm]
C70  value 0,1 мкФ  [C0402-B-0.5mm]
C71  value 10 мкФ  [C0603-B-0.8mm]
C72  value 10 мкФ  [C0603-B-0.8mm]
DD5  LMK1D1204RGTR  [16-QFN-3-H1-EP1.7]
DD6  SY89321LMG  [8-MLF]
DD7  SY89327LMG  [8-MLF]
L14  value 3,4 кОм (500 МГц)  [L0402-B-0.5mm]
L15  value 3,4 кОм (500 МГц)  [L0402-B-0.5mm]
L16  value 3,4 кОм (500 МГц)  [L0402-B-0.5mm]
R22  value 49,9  [CR0402-B-0.35mm]
R33  (no value)  [CR0402-B-0.35mm]
R34  (no value)  [CR0402-B-0.35mm]
R35  (no value)  [CR0402-B-0.35mm]
R36  (no value)  [CR0402-B-0.35mm]
R37  (no value)  [CR0402-B-0.35mm]
R38  (no value)  [CR0402-B-0.35mm]
R39  value 100  [CR0402-B-0.35mm]
R40  value 100  [CR0402-B-0.35mm]
R41  value 100  [CR0402-B-0.35mm]
R42  value 100  [CR0402-B-0.35mm]
R43  value 100  [CR0402-B-0.35mm]
XW5  XW(S)  [SMA-J-P-H-ST-EM1]  (value not drawn)
XW6  XW(P)  [U.FL STR PLG]  (value not drawn)
XW7  XW(P)  [U.FL STR PLG]  (value not drawn)

### Nets
3.3V: C63.1 C65.1 L14.1 L15.2 L16.2 R34.1 R37.1
GND: C61.2 C62.2 C63.2 C64.2 C65.2 C66.2 C67.2 C68.2 C69.2 C70.2 C71.2 C72.2 DD5.1(GND) DD5.PAD(GND) DD6.5(GND) DD6.PAD(GND) DD7.5(GND) DD7.PAD(GND) R22.2 R35.2 R38.2 XW5.2 XW6.2 XW7.2
V_REF_TR_XXV: R33.1
3.3V_BUF_TR: C62.1 C64.1 C66.1 DD5.5(VDD) L14.2
3.3V_VCC_COMP_TRANS: C67.1 C68.1 C69.1 C70.1 C71.1 C72.1 DD6.8(VCC) DD7.8(VCC) L15.1 L16.1
DELAY_CLK_N: DD7.6(nQ)
DELAY_CLK_P: DD7.7(Q)
EXT_TR_CLK_N: C61.1 DD5.4(IN1_N) R33.2 R36.2 R37.2 R38.1 XW7.1
EXT_TR_CLK_P: DD5.3(IN1_P) R34.2 R35.1 R36.1 XW6.1
EXT_TR_CLK_SEL: DD5.2(IN_SEL)
REF_PREDELAY_OUTPUT: DD6.7(Q) R22.1 XW5.1
TDR2_N: DD5.7(IN0_N) R39.2
TDR2_P: DD5.6(IN0_P) R39.1
TR0_N: DD5.10(OUT0_N) DD6.3(nIN) R42.2
TR0_P: DD5.9(OUT0_P) DD6.2(IN) R42.1
TR1_N: DD5.12(OUT1_N) DD7.3(nIN) R43.2
TR1_P: DD5.11(OUT1_P) DD7.2(IN) R43.1
TR2_N: DD5.14(OUT2_N) R41.2
TR2_P: DD5.13(OUT2_P) R41.1
TR3_N: DD5.16(OUT3_N) R40.2
TR3_P: DD5.15(OUT3_P) R40.1

Not connected (* = marked no-connect by the designer): DD5 8(VAC_REF); DD6 1(NC) 4(VBB) 6(NC); DD7 1(NC) 4(NC)

### Layout directives
differential pair: DELAY_CLK_N, DELAY_CLK_P, EXT_TR_CLK_N, EXT_TR_CLK_P, TR0_N, TR0_P, TR1_N, TR1_P, TR2_N, TR2_P, TR3_N, TR3_P
net class S50R: REF_PREDELAY_OUTPUT

### Notes on the sheet
- Перв. примен.
- Справ. №
- Подп. и дата
- Инв. № дубл.
- Взам. инв. №
- Инв. № подл.
- Изм.
- Лист
- № докум.
- Подп.
- Дата
- 2.106-A2
- Копировал
- Формат А2

### Library data of the parts
C61 = Non Polar Ver.: PartNumber: GRM155R71H104KE14D; TemperatureRange: -XX...+XX°C; VoltageRating: 50 В; Manufacturer: *; Package: *; HelpURL: *; Tolerance: *; TypeDielectric: *; ESR: *; ComponentType: CAP
C62 C71 C72 = Non Polar Ver.: as C4 on sheet Э3-1 УВ ЦАП; Manufacturer: *; Package: *; HelpURL: *; Tolerance: *; TypeDielectric: *; ESR: *; ComponentType: CAP
C63-C65 C69 C70 = Non Polar Ver.: as C1 on sheet Э3-1 УВ ЦАП; Manufacturer: *; Package: *; HelpURL: *; Tolerance: *; TypeDielectric: *; ESR: *; ComponentType: CAP
C66-C68 = Non Polar Ver.: as C58 on sheet Э3-2 УВ Компаратор; Manufacturer: *; Package: *; HelpURL: *; Tolerance: *; TypeDielectric: *; ESR: *; ComponentType: CAP
DD5 = LMK1D1204: Low Additive Jitter LVDS Buffer; Manufacturer: Texas Instruments, Inc.; TemperatureRange: -40...+85°C; Package: 16-VQFN; PartNumber: LMK1D1204RGTR; ComponentType: IC; DatasheetURL: *; HelpURL: *; PinCount: 16
DD6 = SY89321L: as DD4 on sheet Э3-2 УВ Компаратор; Package: 8-MLF; PartNumber: SY89321LMG; ComponentType: IC; DatasheetURL: *; HelpURL: *; PinCount: 8
DD7 = SY89327L: 3.3V 2.5Gbps ANY INPUT-to-LVPECL DIFFERENTIAL TRANSLATOR; Manufacturer: Microchip Technology; TemperatureRange: -40...+85°C; Package: 8-QFN; PartNumber: SY89327LMG; ComponentType: IC; DatasheetURL: *; HelpURL: *; PinCount: 8
L14-L16 = Inductor MC Hor.: as L1 on sheet Э3-1 УВ ЦАП; Manufacturer: *; Package: *; HelpURL: *; MaxCurrent: *; ComponentType: IND; DatasheetURL: *; PinCount: 2
R22 = Resistor Ver.: 0402 49,9 Ом ±1 %; TemperatureRange: -XX...+XX°C; Manufacturer: *; PartNumber: *; Package: *; HelpURL: *; PowerRating: *; DatasheetURL: *; Tolerance: *; ComponentType: RES
R33-R38 = Resistor Ver.: TemperatureRange: -XX...+XX°C; Manufacturer: *; PartNumber: *; Package: *; HelpURL: *; PowerRating: *; DatasheetURL: *; Tolerance: *; ComponentType: RES
R39-R43 = Resistor Ver.: 0402 100 Ом ±1 %; TemperatureRange: -XX...+XX°C; Manufacturer: *; PartNumber: *; Package: *; HelpURL: *; PowerRating: *; DatasheetURL: *; Tolerance: *; ComponentType: RES
XW5 = XW(S): TemperatureRange: -XX...+XX°C; Manufacturer: *; Package: *; HelpURL: *; DatasheetURL: *; PartNumber: *; PinCount: 2; ComponentType: Connector
XW6 XW7 = XW(P): TemperatureRange: -XX...+XX°C; Manufacturer: *; Package: *; HelpURL: *; DatasheetURL: *; PartNumber: *; PinCount: 2; ComponentType: Connector

## Sheet Э3-4 TDR Делитель.SchDoc
size 594 x 420 mm; Address1: Address1; Address2: Address2; Address3: Address3; Address4: Address4; DocumentNumber: АБВГ.123456.001 Э3; SheetNumber: 5; SheetTotal: 7; Scale: 1:1; DocumentType: Схема электрическая принципиальная; FirstReferrence: АБВГ.123456.001
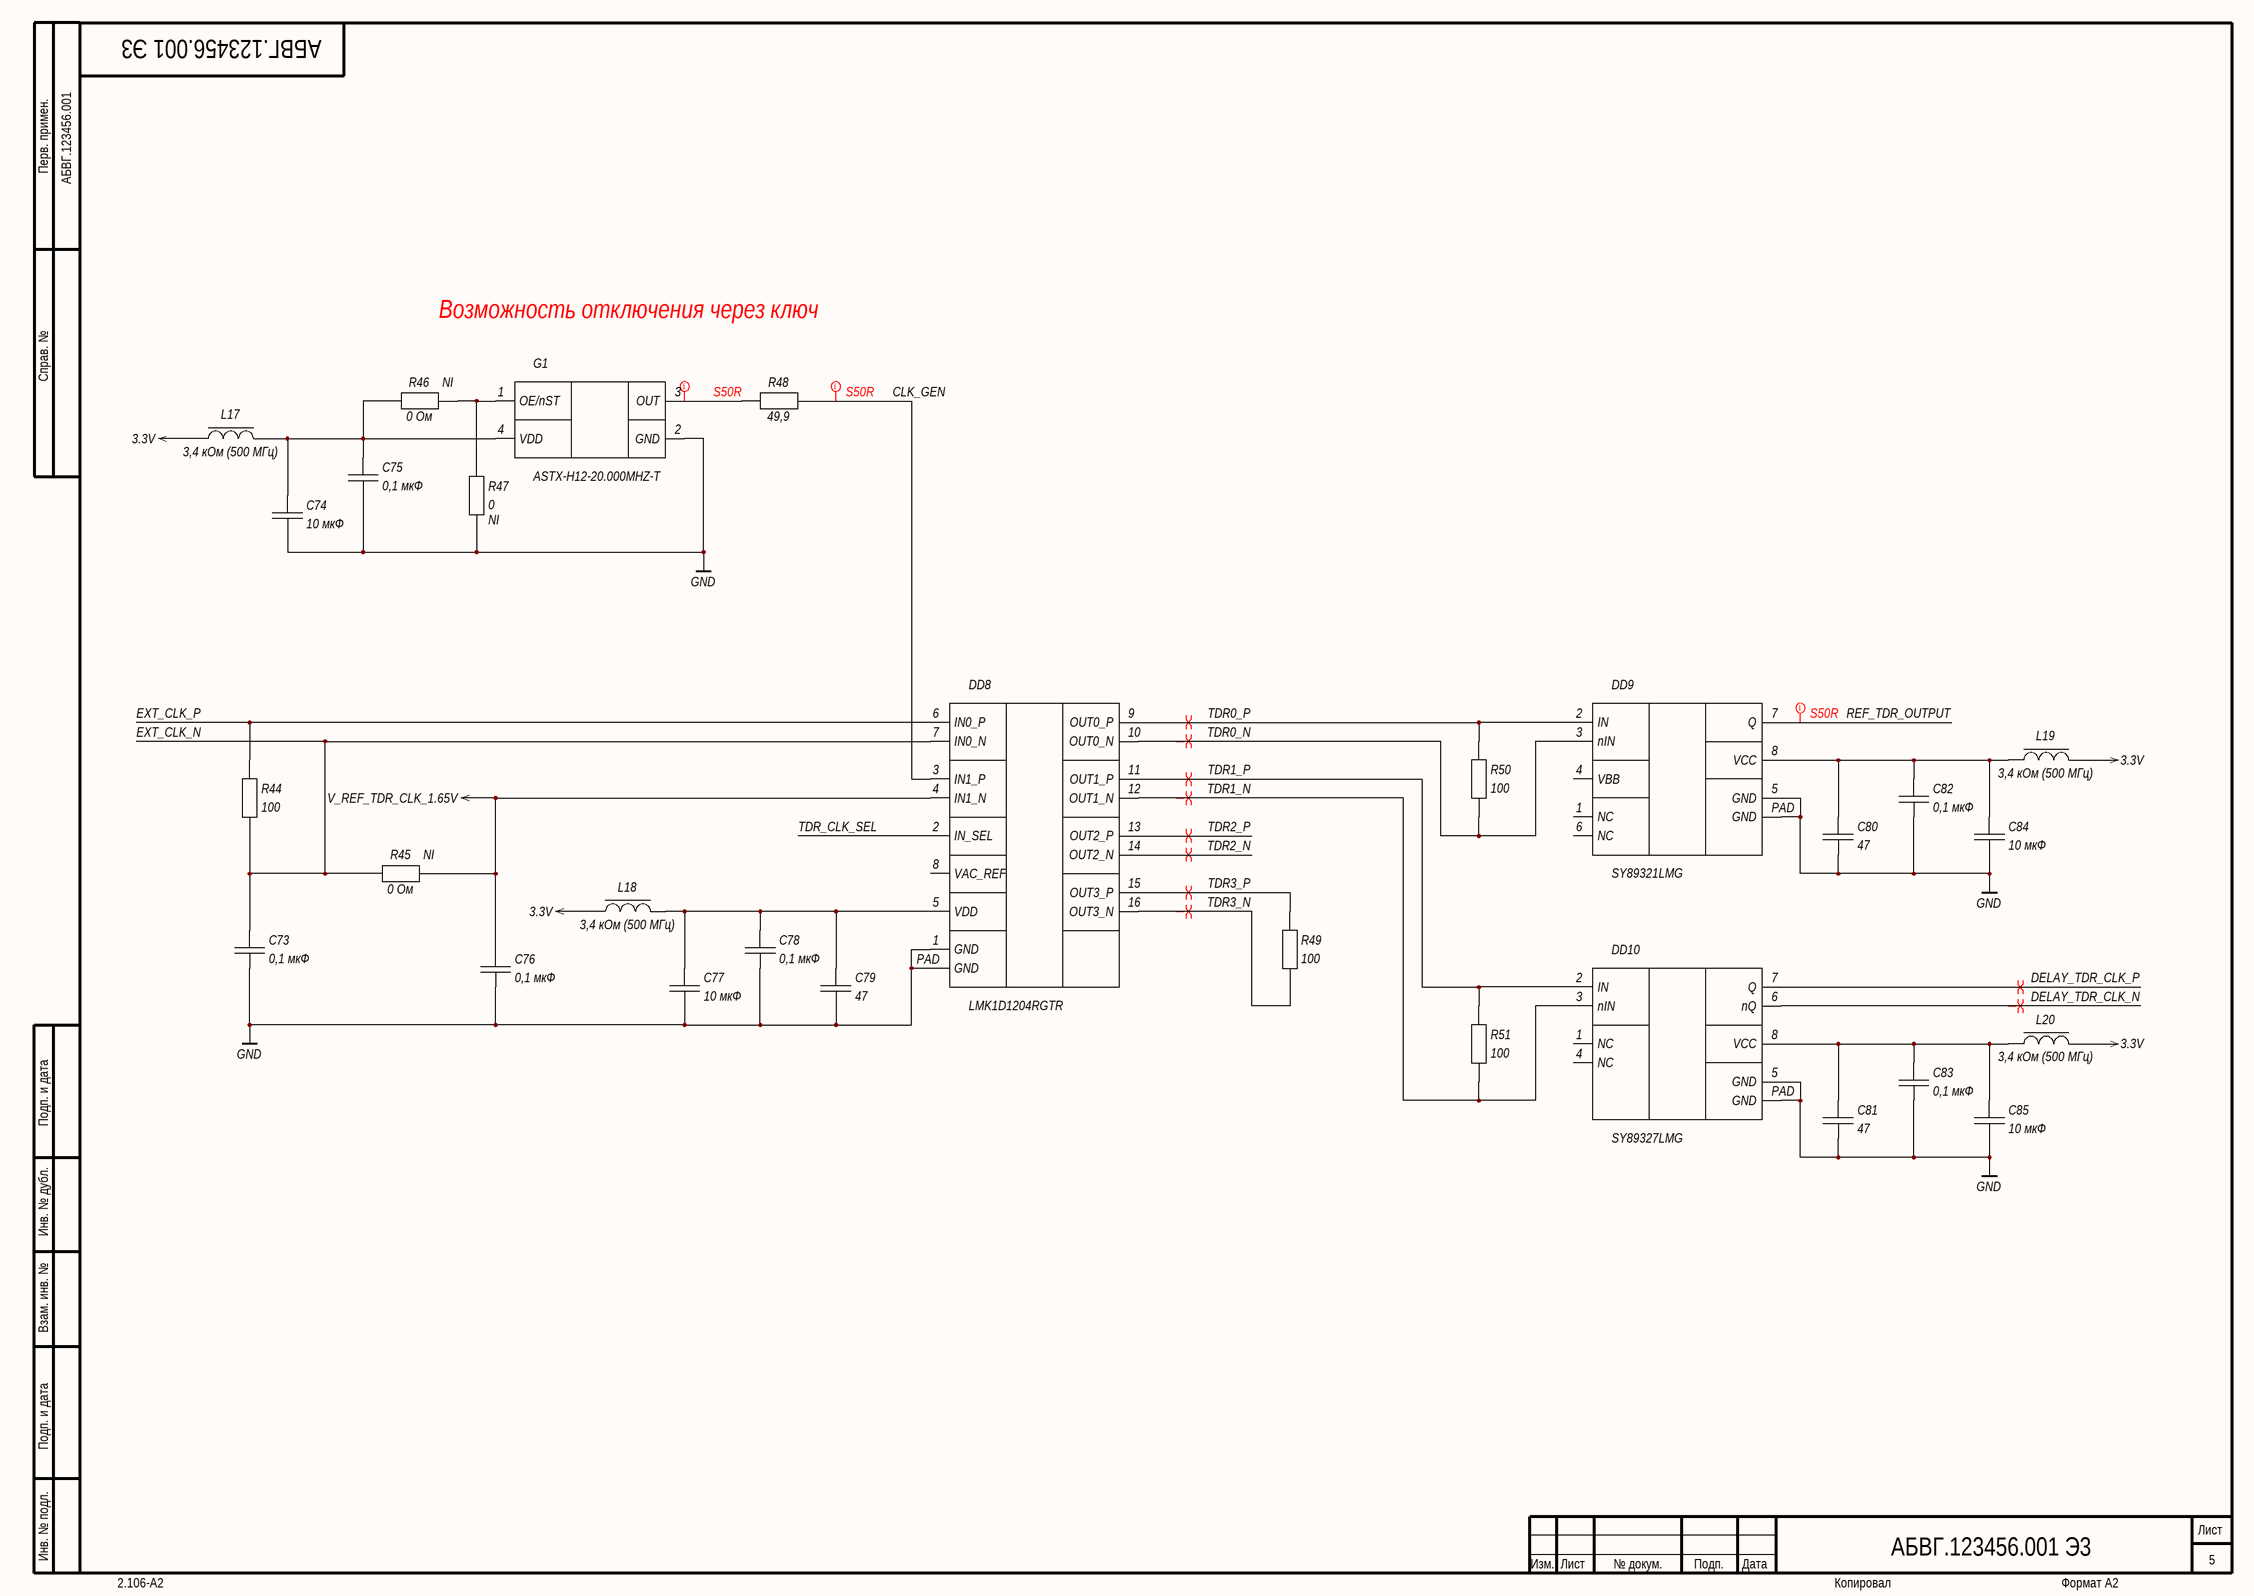
[diagram p4: Э3-4 TDR Делитель.SchDoc]

### Parts
C73  value 0,1 мкФ  [C0402-B-0.5mm]
C74  value 10 мкФ  [C0603-B-0.8mm]
C75  value 0,1 мкФ  [C0402-B-0.5mm]
C76  value 0,1 мкФ  [C0402-B-0.5mm]
C77  value 10 мкФ  [C0603-B-0.8mm]
C78  value 0,1 мкФ  [C0402-B-0.5mm]
C79  value 47  [C0402-B-0.5mm]
C80  value 47  [C0402-B-0.5mm]
C81  value 47  [C0402-B-0.5mm]
C82  value 0,1 мкФ  [C0402-B-0.5mm]
C83  value 0,1 мкФ  [C0402-B-0.5mm]
C84  value 10 мкФ  [C0603-B-0.8mm]
C85  value 10 мкФ  [C0603-B-0.8mm]
DD8  LMK1D1204RGTR  [16-QFN-3-H1-EP1.7]
DD9  SY89321LMG  [8-MLF]
DD10  SY89327LMG  [8-MLF]
G1  ASTX-H12-20.000MHZ-T  [ASTX-H12]
L17  value 3,4 кОм (500 МГц)  [L0402-B-0.5mm]
L18  value 3,4 кОм (500 МГц)  [L0402-B-0.5mm]
L19  value 3,4 кОм (500 МГц)  [L0402-B-0.5mm]
L20  value 3,4 кОм (500 МГц)  [L0402-B-0.5mm]
R44  value 100  [CR0402-B-0.35mm]
R45  value 0 Ом  ComponentType: NI  [CR0402-B-0.35mm]
R46  value 0 Ом  ComponentType: NI  [CR0402-B-0.35mm]
R47  value 0  ComponentType: NI  [CR0402-B-0.35mm]
R48  value 49,9  [CR0402-B-0.35mm]
R49  value 100  [CR0402-B-0.35mm]
R50  value 100  [CR0402-B-0.35mm]
R51  value 100  [CR0402-B-0.35mm]

### Nets
3.3V: L17.1 L18.1 L19.2 L20.2
GND: C73.2 C74.2 C75.2 C76.2 C77.2 C78.2 C79.2 C80.2 C81.2 C82.2 C83.2 C84.2 C85.2 DD8.1(GND) DD8.PAD(GND) DD9.5(GND) DD9.PAD(GND) DD10.5(GND) DD10.PAD(GND) G1.2(GND) R47.2
V_REF_TDR_CLK_1.65V: C76.1 DD8.4(IN1_N) R45.2
CLK_GEN: DD8.3(IN1_P) R48.2
DELAY_TDR_CLK_N: DD10.6(nQ)
DELAY_TDR_CLK_P: DD10.7(Q)
EXT_CLK_N: C73.1 DD8.7(IN0_N) R44.2 R45.1
EXT_CLK_P: DD8.6(IN0_P) R44.1
REF_TDR_OUTPUT: DD9.7(Q)
TDR0_N: DD8.10(OUT0_N) DD9.3(nIN) R50.2
TDR0_P: DD8.9(OUT0_P) DD9.2(IN) R50.1
TDR1_N: DD8.12(OUT1_N) DD10.3(nIN) R51.2
TDR1_P: DD8.11(OUT1_P) DD10.2(IN) R51.1
TDR2_N: DD8.14(OUT2_N)
TDR2_P: DD8.13(OUT2_P)
TDR3_N: DD8.16(OUT3_N) R49.2
TDR3_P: DD8.15(OUT3_P) R49.1
TDR_CLK_SEL: DD8.2(IN_SEL)
NetC74_1: C74.1 C75.1 G1.4(VDD) L17.2 R46.1
NetC77_1: C77.1 C78.1 C79.1 DD8.5(VDD) L18.2
NetC80_1: C80.1 C82.1 C84.1 DD9.8(VCC) L19.1
NetC81_1: C81.1 C83.1 C85.1 DD10.8(VCC) L20.1
NetG1_1: G1.1(OE/nST) R46.2 R47.1
NetG1_3: G1.3(OUT) R48.1

Not connected (* = marked no-connect by the designer): DD8 8(VAC_REF); DD9 1(NC) 4(VBB) 6(NC); DD10 1(NC) 4(NC)

### Layout directives
differential pair: DELAY_TDR_CLK_N, DELAY_TDR_CLK_P, TDR0_N, TDR0_P, TDR1_N, TDR1_P, TDR2_N, TDR2_P, TDR3_N, TDR3_P
net class S50R: CLK_GEN, NetG1_3, REF_TDR_OUTPUT

### Notes on the sheet
- Возможность отключения через ключ
- Перв. примен.
- Справ. №
- Подп. и дата
- Инв. № дубл.
- Взам. инв. №
- Инв. № подл.
- Изм.
- Лист
- № докум.
- Подп.
- Дата
- 2.106-A2
- Копировал
- Формат А2

### Library data of the parts
C73 C75 C76 C78 C82 C83 = Non Polar Ver.: as C1 on sheet Э3-1 УВ ЦАП; Manufacturer: *; Package: *; HelpURL: *; Tolerance: *; TypeDielectric: *; ESR: *; ComponentType: CAP
C74 C77 C84 C85 = Non Polar Ver.: as C4 on sheet Э3-1 УВ ЦАП; Manufacturer: *; Package: *; HelpURL: *; Tolerance: *; TypeDielectric: *; ESR: *; ComponentType: CAP
C79-C81 = Non Polar Ver.: as C58 on sheet Э3-2 УВ Компаратор; Manufacturer: *; Package: *; HelpURL: *; Tolerance: *; TypeDielectric: *; ESR: *; ComponentType: CAP
DD8 = LMK1D1204: as DD5 on sheet Э3-3 Внешний триггер; Package: 16-VQFN; PartNumber: LMK1D1204RGTR; ComponentType: IC; DatasheetURL: *; HelpURL: *; PinCount: 16
DD9 = SY89321L: as DD4 on sheet Э3-2 УВ Компаратор; Package: 8-MLF; PartNumber: SY89321LMG; ComponentType: IC; DatasheetURL: *; HelpURL: *; PinCount: 8
DD10 = SY89327L: as DD7 on sheet Э3-3 Внешний триггер; Package: 8-QFN; PartNumber: SY89327LMG; ComponentType: IC; DatasheetURL: *; HelpURL: *; PinCount: 8
G1 = Generator: TemperatureRange: -...+°C; Tolerance: ± ppm; PartNumber: ASTX-H12-20.000MHZ-T; Manufacturer: *; HelpURL: *; ComponentType: GEN; DatasheetURL: *; Package: *; PinCount: 4; Frequency: *; LoadCapacitance: *
L17-L20 = Inductor MC Hor.: as L1 on sheet Э3-1 УВ ЦАП; Manufacturer: *; Package: *; HelpURL: *; MaxCurrent: *; ComponentType: IND; DatasheetURL: *; PinCount: 2
R44 R49-R51 = Resistor Ver.: as R39 on sheet Э3-3 Внешний триггер; Manufacturer: *; PartNumber: *; Package: *; HelpURL: *; PowerRating: *; DatasheetURL: *; Tolerance: *; ComponentType: RES
R45 R46 = Resistor Hor.: 0402 0 Ом; TemperatureRange: -XX...+XX°C; Manufacturer: *; PartNumber: *; Package: *; HelpURL: *; PowerRating: *; Tolerance: *; DatasheetURL: *
R47 = Resistor Ver.: 0402 0 Ом; TemperatureRange: -XX...+XX°C; Manufacturer: *; PartNumber: *; Package: *; HelpURL: *; PowerRating: *; DatasheetURL: *; Tolerance: *
R48 = Resistor Hor.: 0402 49,9 Ом ±1 %; TemperatureRange: -XX...+XX°C; Manufacturer: *; PartNumber: *; Package: *; HelpURL: *; PowerRating: *; Tolerance: *; DatasheetURL: *; ComponentType: RES

## Sheet Э3-5 TDR Генератор.SchDoc
size 594 x 420 mm; Address1: Address1; Address2: Address2; Address3: Address3; Address4: Address4; DocumentNumber: АБВГ.123456.001 Э3; SheetNumber: 6; SheetTotal: 7; Scale: 1:1; DocumentType: Схема электрическая принципиальная; FirstReferrence: АБВГ.123456.001
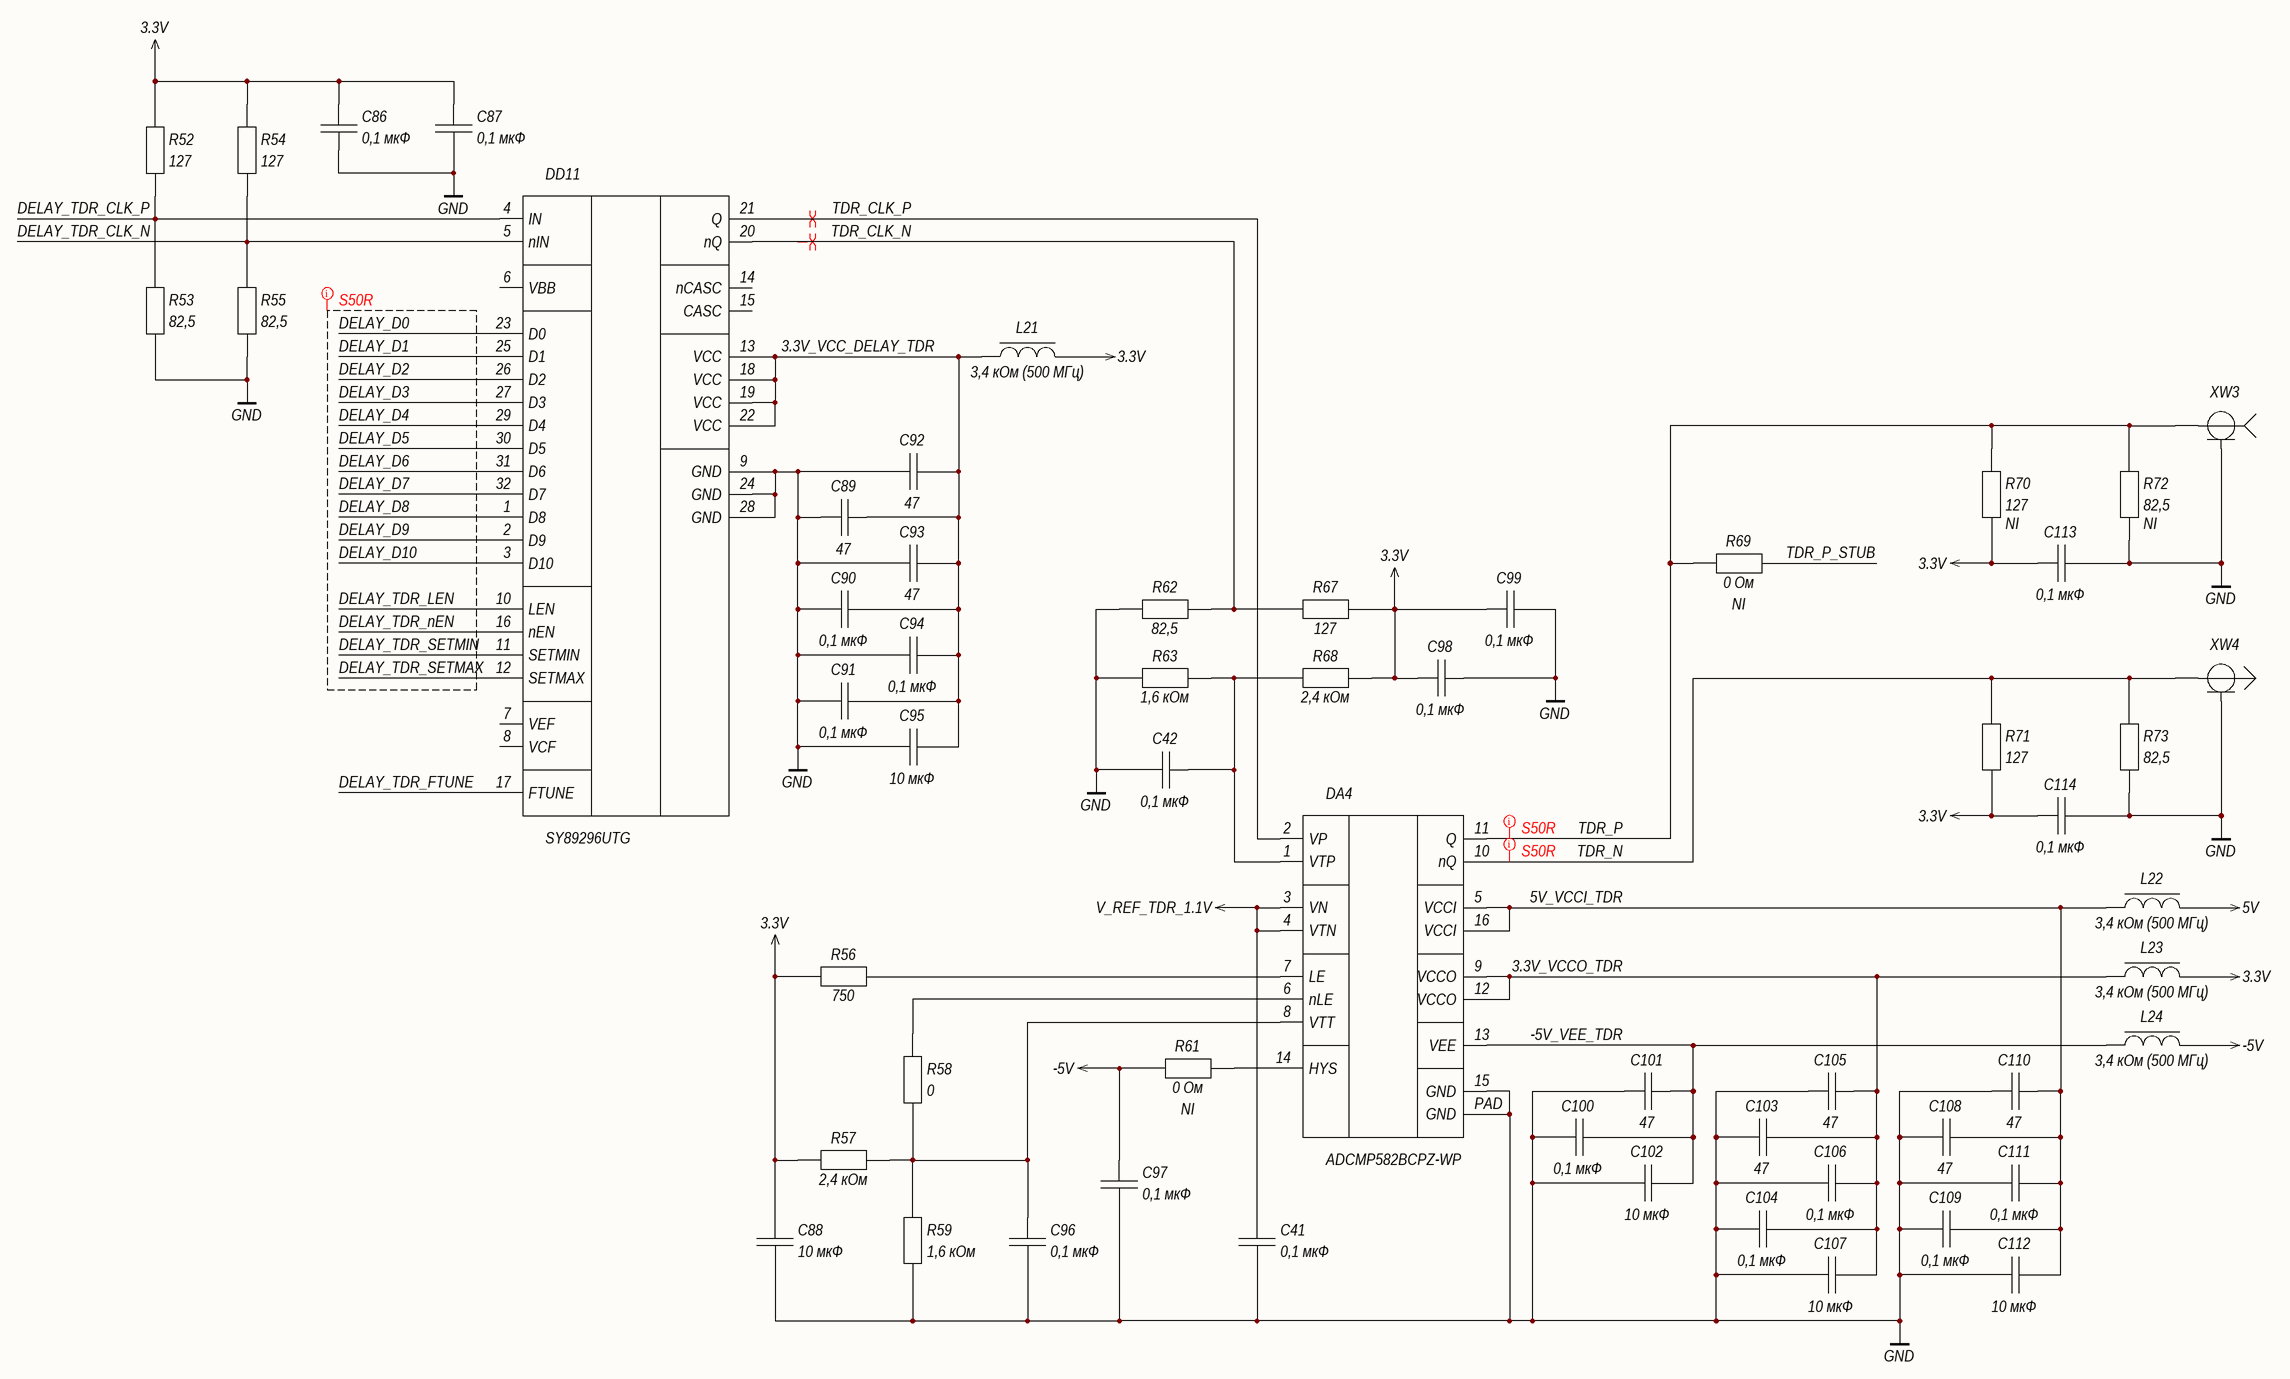
[diagram p5: Э3-5 TDR Генератор.SchDoc]

### Parts
C41  value 0,1 мкФ  [C0402-B-0.5mm]
C42  value 0,1 мкФ  [C0402-B-0.5mm]
C86  value 0,1 мкФ  [C0402-B-0.5mm]
C87  value 0,1 мкФ  [C0402-B-0.5mm]
C88  value 10 мкФ  [C0603-B-0.8mm]
C89  value 47  [C0402-B-0.5mm]
C90  value 0,1 мкФ  [C0402-B-0.5mm]
C91  value 0,1 мкФ  [C0402-B-0.5mm]
C92  value 47  [C0402-B-0.5mm]
C93  value 47  [C0402-B-0.5mm]
C94  value 0,1 мкФ  [C0402-B-0.5mm]
C95  value 10 мкФ  [C0603-B-0.8mm]
C96  value 0,1 мкФ  [C0402-B-0.5mm]
C97  value 0,1 мкФ  [C0402-B-0.5mm]
C98  value 0,1 мкФ  [C0402-B-0.5mm]
C99  value 0,1 мкФ  [C0402-B-0.5mm]
C100  value 0,1 мкФ  [C0402-B-0.5mm]
C101  value 47  [C0402-B-0.5mm]
C102  value 10 мкФ  [C0603-B-0.8mm]
C103  value 47  [C0402-B-0.5mm]
C104  value 0,1 мкФ  [C0402-B-0.5mm]
C105  value 47  [C0402-B-0.5mm]
C106  value 0,1 мкФ  [C0402-B-0.5mm]
C107  value 10 мкФ  [C0603-B-0.8mm]
C108  value 47  [C0402-B-0.5mm]
C109  value 0,1 мкФ  [C0402-B-0.5mm]
C110  value 47  [C0402-B-0.5mm]
C111  value 0,1 мкФ  [C0402-B-0.5mm]
C112  value 10 мкФ  [C0603-B-0.8mm]
C113  value 0,1 мкФ  [C0402-B-0.5mm]
C114  value 0,1 мкФ  [C0402-B-0.5mm]
DA4  ADCMP582BCPZ-WP  [16-LFCSP-3-H0.75]
DD11  SY89296UTG  [32-TQFP-B]
L21  value 3,4 кОм (500 МГц)  [L0402-B-0.5mm]
L22  value 3,4 кОм (500 МГц)  [L0402-B-0.5mm]
L23  value 3,4 кОм (500 МГц)  [L0402-B-0.5mm]
L24  value 3,4 кОм (500 МГц)  [L0402-B-0.5mm]
R52  value 127  [CR0402-B-0.35mm]
R53  value 82,5  [CR0402-B-0.35mm]
R54  value 127  [CR0402-B-0.35mm]
R55  value 82,5  [CR0402-B-0.35mm]
R56  value 750  [CR0402-B-0.35mm]
R57  value 2,4 кОм  [CR0402-B-0.35mm]
R58  value 0  [CR0402-B-0.35mm]
R59  value 1,6 кОм  [CR0402-B-0.35mm]
R61  value 0 Ом  ComponentType: NI  [CR0402-B-0.35mm]
R62  value 82,5  [CR0402-B-0.35mm]
R63  value 1,6 кОм  [CR0402-B-0.35mm]
R67  value 127  [CR0402-B-0.35mm]
R68  value 2,4 кОм  [CR0402-B-0.35mm]
R69  value 0 Ом  ComponentType: NI  [CR0402-B-0.35mm]
R70  value 127  ComponentType: NI  [CR0402-B-0.35mm]
R71  value 127  [CR0402-B-0.35mm]
R72  value 82,5  ComponentType: NI  [CR0402-B-0.35mm]
R73  value 82,5  [CR0402-B-0.35mm]
XW3  XW(S)  [SMA-J-P-H-ST-EM1]  (value not drawn)
XW4  XW(P)  [U.FL STR PLG]  (value not drawn)

### Nets
3.3V: C86.1 C87.1 C88.1 C98.1 C99.1 C113.1 C114.1 L21.2 L23.2 R52.1 R54.1 R56.1 R57.1 R67.2 R68.2 R70.2 R71.2
5V: L22.2
-5V: C97.1 L24.2 R61.1
GND: C41.2 C42.1 C86.2 C87.2 C88.2 C89.1 C90.1 C91.1 C92.1 C93.1 C94.1 C95.1 C96.2 C97.2 C98.2 C99.2 C100.1 C101.1 C102.1 C103.1 C104.1 C105.1 C106.1 C107.1 C108.1 C109.1 C110.1 C111.1 C112.1 C113.2 C114.2 DA4.15(GND) DA4.PAD(GND) DD11.9(GND) DD11.24(GND) DD11.28(GND) R53.2 R55.2 R59.2 R62.1 R63.1 R72.2 R73.2 XW3.2 XW4.2
V_REF_TDR_1.1V: C41.1 DA4.3(VN) DA4.4(VTN)
3.3V_VCC_DELAY_TDR: C89.2 C90.2 C91.2 C92.2 C93.2 C94.2 C95.2 DD11.13(VCC) DD11.18(VCC) DD11.19(VCC) DD11.22(VCC) L21.1
3.3V_VCCO_TDR: C103.2 C104.2 C105.2 C106.2 C107.2 DA4.9(VCCO) DA4.12(VCCO) L23.1
5V_VCCI_TDR: C108.2 C109.2 C110.2 C111.2 C112.2 DA4.5(VCCI) DA4.16(VCCI) L22.1
-5V_VEE_TDR: C100.2 C101.2 C102.2 DA4.13(VEE) L24.1
DELAY_D0: DD11.23(D0)
DELAY_D1: DD11.25(D1)
DELAY_D2: DD11.26(D2)
DELAY_D3: DD11.27(D3)
DELAY_D4: DD11.29(D4)
DELAY_D5: DD11.30(D5)
DELAY_D6: DD11.31(D6)
DELAY_D7: DD11.32(D7)
DELAY_D8: DD11.1(D8)
DELAY_D9: DD11.2(D9)
DELAY_D10: DD11.3(D10)
DELAY_TDR_CLK_N: DD11.5(nIN) R54.2 R55.1
DELAY_TDR_CLK_P: DD11.4(IN) R52.2 R53.1
DELAY_TDR_FTUNE: DD11.17(FTUNE)
DELAY_TDR_LEN: DD11.10(LEN)
DELAY_TDR_nEN: DD11.16(nEN)
DELAY_TDR_SETMAX: DD11.12(SETMAX)
DELAY_TDR_SETMIN: DD11.11(SETMIN)
TDR_CLK_N: DD11.20(nQ) R62.2 R67.1
TDR_CLK_P: DA4.2(VP) DD11.21(Q)
TDR_N: DA4.10(nQ) R71.1 R73.1 XW4.1
TDR_P: DA4.11(Q) R69.1 R70.1 R72.1 XW3.1
TDR_P_STUB: R69.2
NetC42_2: C42.2 DA4.1(VTP) R63.2 R68.1
NetC96_1: C96.1 DA4.8(VTT) R57.2 R58.2 R59.1
NetDA4_6: DA4.6(nLE) R58.1
NetDA4_7: DA4.7(LE) R56.2
NetDA4_14: DA4.14(HYS) R61.2

Not connected (* = marked no-connect by the designer): DD11 6(VBB) 7(VEF) 8(VCF) 14(nCASC) 15(CASC)

### Layout directives
differential pair: TDR_CLK_N, TDR_CLK_P
net class S50R: DELAY_D0, DELAY_D1, DELAY_D2, DELAY_D3, DELAY_D4, DELAY_D5, DELAY_D6, DELAY_D7, DELAY_D8, DELAY_D9, DELAY_D10, DELAY_TDR_LEN, DELAY_TDR_nEN, DELAY_TDR_SETMAX, DELAY_TDR_SETMIN, TDR_N, TDR_P

### Notes on the sheet
- Перв. примен.
- Справ. №
- Подп. и дата
- Инв. № дубл.
- Взам. инв. №
- Инв. № подл.
- Изм.
- Лист
- № докум.
- Подп.
- Дата
- 2.106-A2
- Копировал
- Формат А2

### Library data of the parts
C41 C86 C87 C96 C97 = Non Polar Ver.: as C1 on sheet Э3-1 УВ ЦАП; Manufacturer: *; Package: *; HelpURL: *; Tolerance: *; TypeDielectric: *; ESR: *; ComponentType: CAP
C42 C90 C91 C94 C98-C100 C104 C106 C109 C111 C113 C114 = Non Polar Hor.: as C3 on sheet Э3-1 УВ ЦАП; Manufacturer: *; Package: *; HelpURL: *; Tolerance: *; TypeDielectric: *; ESR: *; ComponentType: CAP
C88 = Non Polar Ver.: as C4 on sheet Э3-1 УВ ЦАП; Manufacturer: *; Package: *; HelpURL: *; Tolerance: *; TypeDielectric: *; ESR: *; ComponentType: CAP
C89 C92 C93 C101 C103 C105 C108 C110 = Non Polar Hor.: as C32 on sheet Э3-2 УВ Компаратор; Manufacturer: *; Package: *; HelpURL: *; Tolerance: *; TypeDielectric: *; ESR: *; ComponentType: CAP
C95 C102 C107 C112 = Non Polar Hor.: as C38 on sheet Э3-2 УВ Компаратор; Manufacturer: *; Package: *; HelpURL: *; Tolerance: *; TypeDielectric: *; ESR: *; ComponentType: CAP
DA4 = ADCMP582: as DA3 on sheet Э3-2 УВ Компаратор; Package: 16-LFCSP; PartNumber: ADCMP582BCPZ-WP; ComponentType: IC; DatasheetURL: *; HelpURL: *; PinCount: 16
DD11 = SY89296UTG: as DD3 on sheet Э3-2 УВ Компаратор; Package: 32-TQFP; DatasheetURL: *; HelpURL: *; PinCount: 32; PartNumber: SY89296UTG; ComponentType: IC
L21-L24 = Inductor MC Hor.: as L1 on sheet Э3-1 УВ ЦАП; Manufacturer: *; Package: *; HelpURL: *; MaxCurrent: *; ComponentType: IND; DatasheetURL: *; PinCount: 2
R52 R54 R70 R71 = Resistor Ver.: as R15 on sheet Э3-2 УВ Компаратор; Manufacturer: *; PartNumber: *; Package: *; HelpURL: *; PowerRating: *; DatasheetURL: *; Tolerance: *
  R52 R54 R71: ComponentType: RES
R53 R55 R72 R73 = Resistor Ver.: as R16 on sheet Э3-2 УВ Компаратор; Manufacturer: *; PartNumber: *; Package: *; HelpURL: *; PowerRating: *; DatasheetURL: *; Tolerance: *
  R53 R55 R73: ComponentType: RES
R56 = Resistor Hor.: 0402 750 Ом ±5 %; TemperatureRange: -XX...+XX°C; Manufacturer: *; PartNumber: *; Package: *; HelpURL: *; PowerRating: *; Tolerance: *; DatasheetURL: *; ComponentType: RES
R57 R68 = Resistor Hor.: as R19 on sheet Э3-2 УВ Компаратор; Manufacturer: *; PartNumber: *; Package: *; HelpURL: *; PowerRating: *; Tolerance: *; DatasheetURL: *; ComponentType: RES
R58 = Resistor Ver.: 0402 0 Ом; TemperatureRange: -XX...+XX°C; Manufacturer: *; PartNumber: *; Package: *; HelpURL: *; PowerRating: *; DatasheetURL: *; Tolerance: *; ComponentType: RES
R59 = Resistor Ver.: as R21 on sheet Э3-2 УВ Компаратор; Manufacturer: *; PartNumber: *; Package: *; HelpURL: *; PowerRating: *; DatasheetURL: *; Tolerance: *; ComponentType: RES
R61 R69 = Resistor Hor.: 0402 0 Ом; TemperatureRange: -XX...+XX°C; Manufacturer: *; PartNumber: *; Package: *; HelpURL: *; PowerRating: *; Tolerance: *; DatasheetURL: *
R62 = Resistor Hor.: as R29 on sheet Э3-2 УВ Компаратор; Manufacturer: *; PartNumber: *; Package: *; HelpURL: *; PowerRating: *; Tolerance: *; DatasheetURL: *; ComponentType: RES
R63 = Resistor Hor.: 0402 1,6 кОм ±1 %; TemperatureRange: -XX...+XX°C; Manufacturer: *; PartNumber: *; Package: *; HelpURL: *; PowerRating: *; Tolerance: *; DatasheetURL: *; ComponentType: RES
R67 = Resistor Hor.: as R31 on sheet Э3-2 УВ Компаратор; Manufacturer: *; PartNumber: *; Package: *; HelpURL: *; PowerRating: *; Tolerance: *; DatasheetURL: *; ComponentType: RES
XW3 = XW(S): TemperatureRange: -XX...+XX°C; Manufacturer: *; Package: *; HelpURL: *; DatasheetURL: *; PartNumber: *; PinCount: 2; ComponentType: Connector
XW4 = XW(P): TemperatureRange: -XX...+XX°C; Manufacturer: *; Package: *; HelpURL: *; DatasheetURL: *; PartNumber: *; PinCount: 2; ComponentType: Connector

## Sheet Э3-6 Электропитание.SchDoc
size 594 x 420 mm; Address1: Address1; Address2: Address2; Address3: Address3; Address4: Address4; DocumentNumber: АБВГ.123456.001 Э3; SheetNumber: 7; SheetTotal: 7; Scale: 1:1; DocumentType: Схема электрическая принципиальная; FirstReferrence: АБВГ.123456.001
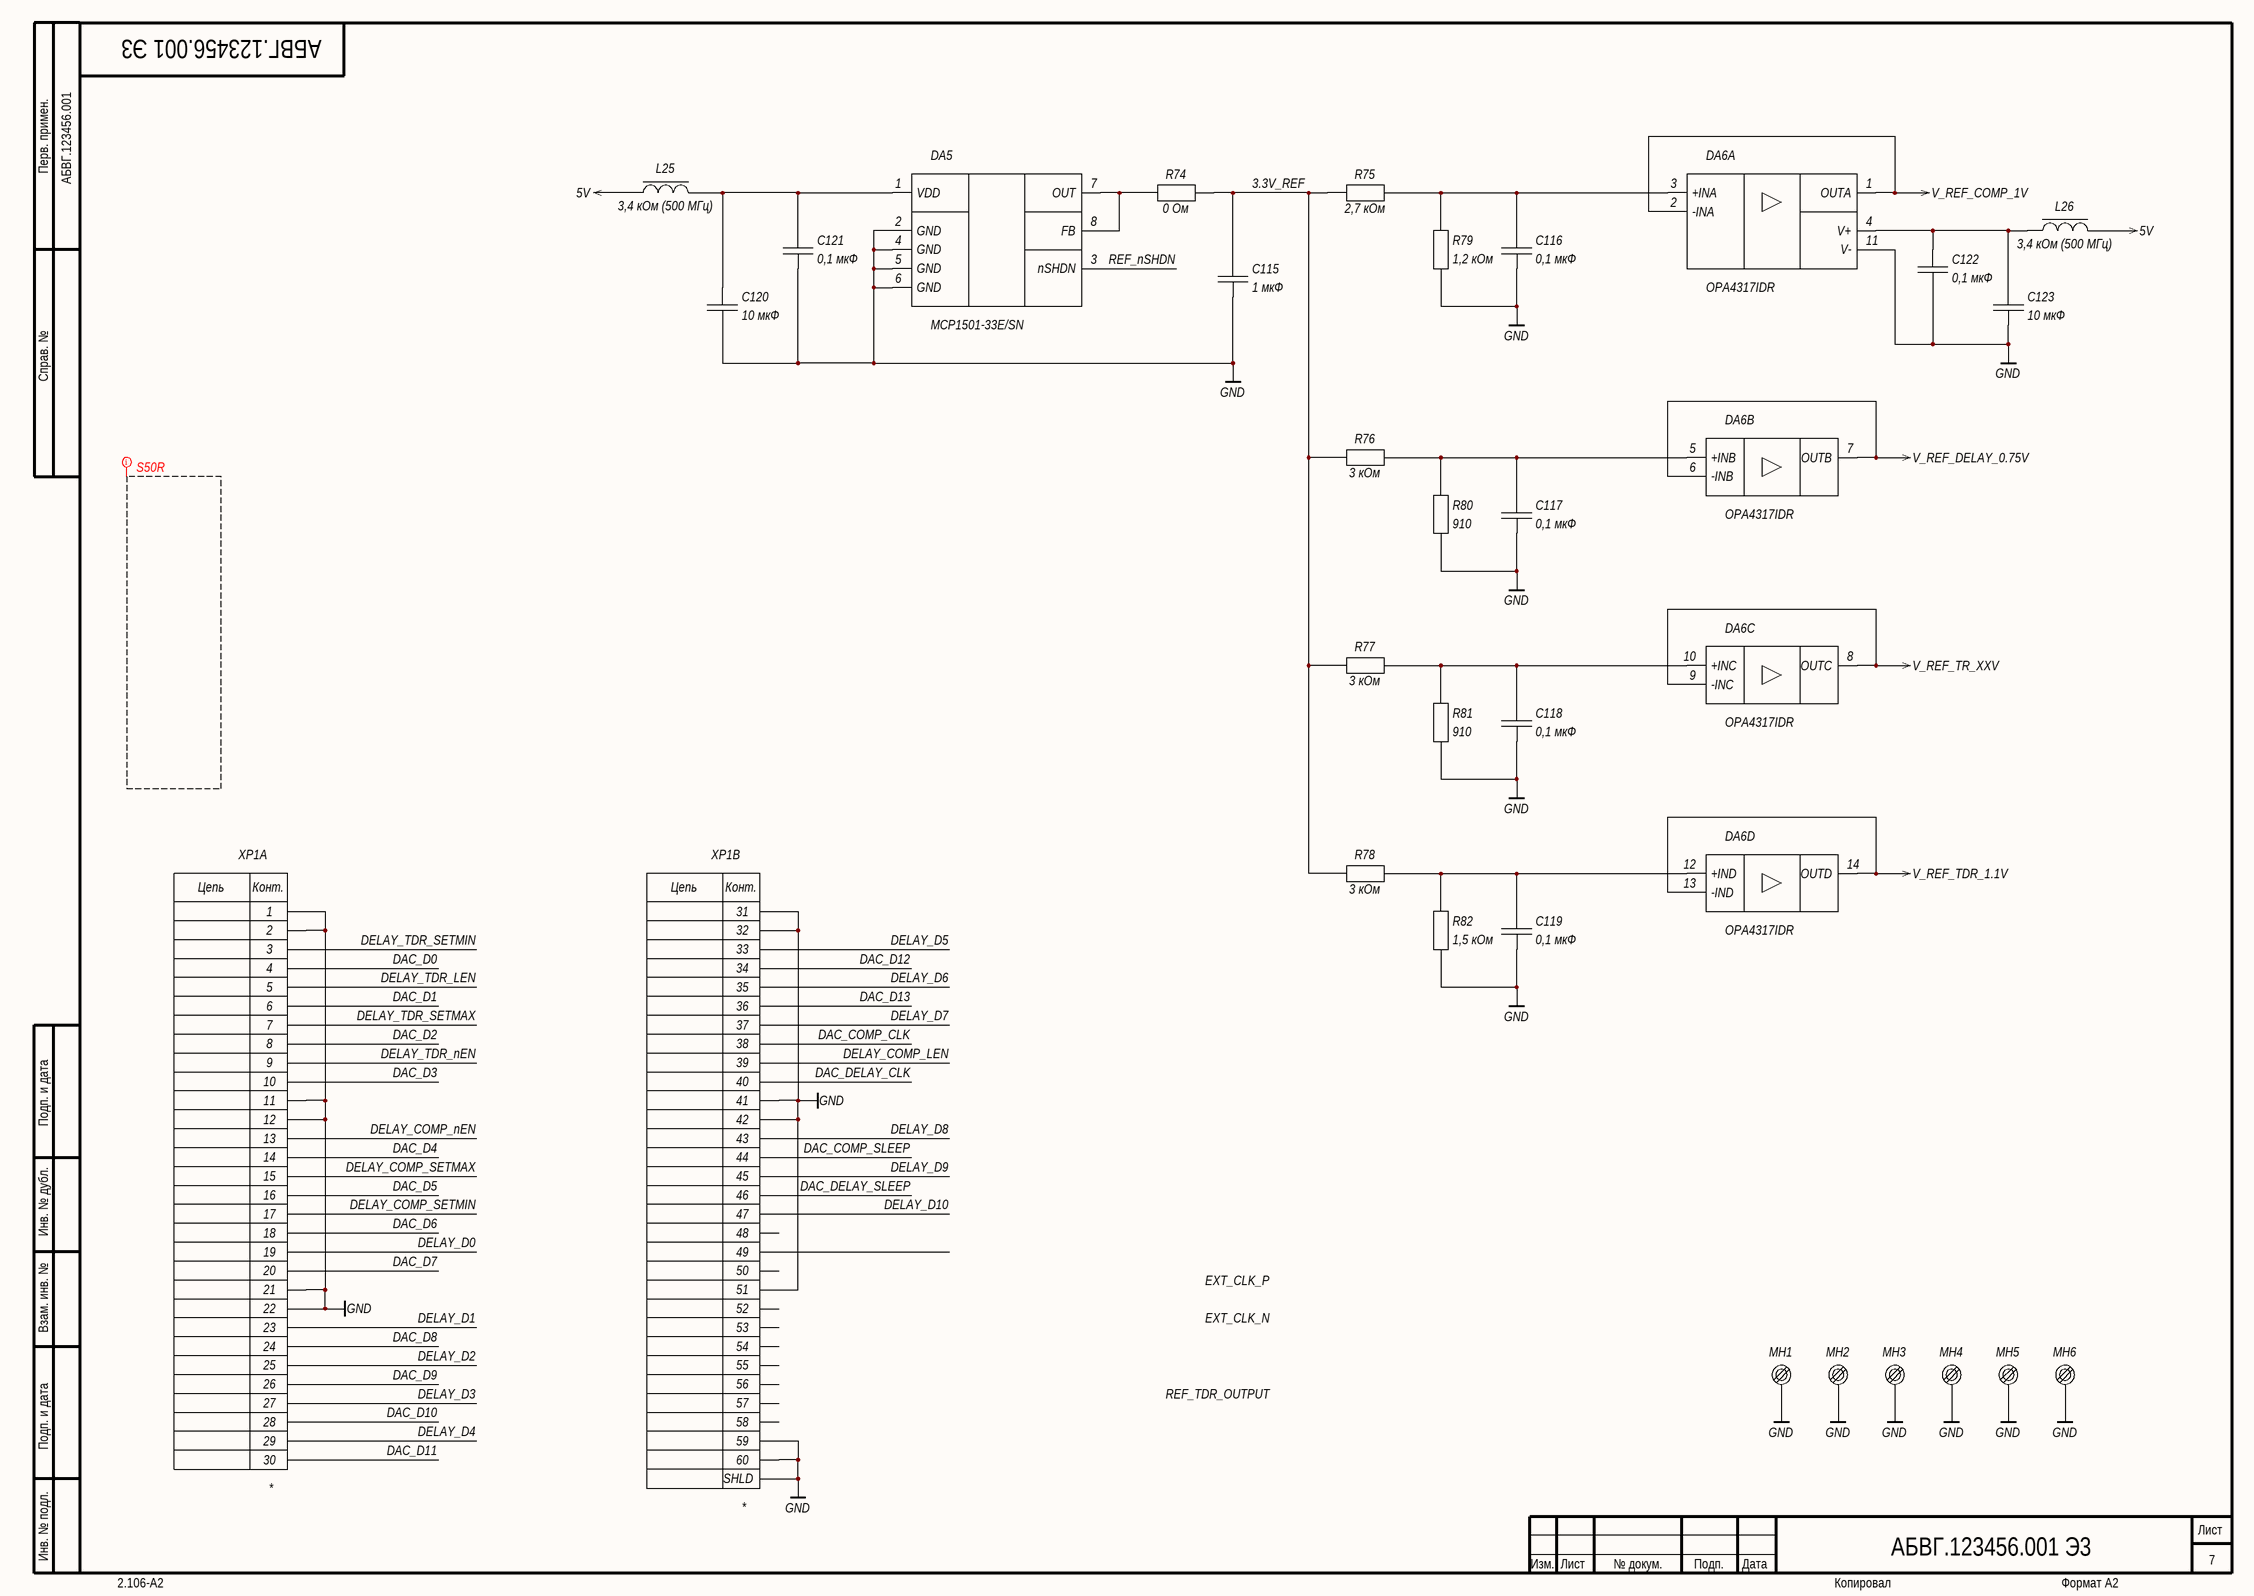
[diagram p6: Э3-6 Электропитание.SchDoc]

### Parts
C115  value 1 мкФ  [C0402-B-0.5mm]
C116  value 0,1 мкФ  [C0402-B-0.5mm]
C117  value 0,1 мкФ  [C0402-B-0.5mm]
C118  value 0,1 мкФ  [C0402-B-0.5mm]
C119  value 0,1 мкФ  [C0402-B-0.5mm]
C120  value 10 мкФ  [C0603-B-0.8mm]
C121  value 0,1 мкФ  [C0402-B-0.5mm]
C122  value 0,1 мкФ  [C0402-B-0.5mm]
C123  value 10 мкФ  [C0603-B-0.8mm]
DA5  MCP1501-33E/SN  [8-SOIC-3.9]
DA6  OPA4317IDR  [14-SOIC-3.9]  (value not drawn)  (parts A,B,C,D of 4)
L25  value 3,4 кОм (500 МГц)  [L0402-B-0.5mm]
L26  value 3,4 кОм (500 МГц)  [L0402-B-0.5mm]
MH1  Mechanical Connection  [Отверстие 2,4x5]  (value not drawn)
MH2  Mechanical Connection  [Отверстие 2,4x5]  (value not drawn)
MH3  Mechanical Connection  [Отверстие 2,4x5]  (value not drawn)
MH4  Mechanical Connection  [Отверстие 2,4x5]  (value not drawn)
MH5  Mechanical Connection  [Отверстие 2,4x5]  (value not drawn)
MH6  Mechanical Connection  [Отверстие 2,4x5]  (value not drawn)
R74  value 0 Ом  [CR0402-B-0.35mm]
R75  value 2,7 кОм  [CR0402-B-0.35mm]
R76  value 3 кОм  [CR0402-B-0.35mm]
R77  value 3 кОм  [CR0402-B-0.35mm]
R78  value 3 кОм  [CR0402-B-0.35mm]
R79  value 1,2 кОм  [CR0402-B-0.35mm]
R80  value 910  [CR0402-B-0.35mm]
R81  value 910  [CR0402-B-0.35mm]
R82  value 1,5 кОм  [CR0402-B-0.35mm]
XP1  *  [AXT460324]  (value not drawn)  (parts A,B of 2)

### Nets
5V: L25.1 L26.2
GND: C115.2 C116.2 C117.2 C118.2 C119.2 C120.2 C121.2 C122.2 C123.2 DA5.2(GND) DA5.4(GND) DA5.5(GND) DA5.6(GND) DA6.11(V-) MH1.0 MH2.0 MH3.0 MH4.0 MH5.0 MH6.0 R79.2 R80.2 R81.2 R82.2 XP1.1 XP1.2 XP1.11 XP1.12 XP1.21 XP1.22 XP1.31 XP1.32 XP1.41 XP1.42 XP1.51 XP1.59 XP1.60 XP1.SHLD
V_REF_COMP_1V: DA6.1(OUTA) DA6.2(-INA)
V_REF_DELAY_0.75V: DA6.6(-INB) DA6.7(OUTB)
V_REF_TDR_1.1V: DA6.13(-IND) DA6.14(OUTD)
V_REF_TR_XXV: DA6.8(OUTC) DA6.9(-INC)
3.3V_REF: C115.1 R74.2 R75.1 R76.1 R77.1 R78.1
DAC_COMP_CLK: XP1.38
DAC_COMP_SLEEP: XP1.44
DAC_D0: XP1.4
DAC_D1: XP1.6
DAC_D2: XP1.8
DAC_D3: XP1.10
DAC_D4: XP1.14
DAC_D5: XP1.16
DAC_D6: XP1.18
DAC_D7: XP1.20
DAC_D8: XP1.24
DAC_D9: XP1.26
DAC_D10: XP1.28
DAC_D11: XP1.30
DAC_D12: XP1.34
DAC_D13: XP1.36
DAC_DELAY_CLK: XP1.40
DAC_DELAY_SLEEP: XP1.46
DELAY_COMP_LEN: XP1.39
DELAY_COMP_nEN: XP1.13
DELAY_COMP_SETMAX: XP1.15
DELAY_COMP_SETMIN: XP1.17
DELAY_D0: XP1.19
DELAY_D1: XP1.23
DELAY_D2: XP1.25
DELAY_D3: XP1.27
DELAY_D4: XP1.29
DELAY_D5: XP1.33
DELAY_D6: XP1.35
DELAY_D7: XP1.37
DELAY_D8: XP1.43
DELAY_D9: XP1.45
DELAY_D10: XP1.47
DELAY_TDR_LEN: XP1.5
DELAY_TDR_nEN: XP1.9
DELAY_TDR_SETMAX: XP1.7
DELAY_TDR_SETMIN: XP1.3
REF_nSHDN: DA5.3(nSHDN)
NetC116_1: C116.1 DA6.3(+INA) R75.2 R79.1
NetC117_1: C117.1 DA6.5(+INB) R76.2 R80.1
NetC118_1: C118.1 DA6.10(+INC) R77.2 R81.1
NetC119_1: C119.1 DA6.12(+IND) R78.2 R82.1
NetC120_1: C120.1 C121.1 DA5.1(VDD) L25.2
NetC122_1: C122.1 C123.1 DA6.4(V+) L26.1
NetDA5_7: DA5.7(OUT) DA5.8(FB) R74.1

Not connected (* = marked no-connect by the designer): XP1 48 49 50 52 53 54 55 56 57 58

### Layout directives
net class S50R: (no net found under the mark)

### Notes on the sheet
- Цепь
- Labels drawn without touching a wire or pin: EXT_CLK_N, EXT_CLK_P, REF_TDR_OUTPUT
- Перв. примен.
- Справ. №
- Подп. и дата
- Инв. № дубл.
- Взам. инв. №
- Инв. № подл.
- Изм.
- Лист
- № докум.
- Подп.
- Дата
- 2.106-A2
- Копировал
- Формат А2
- (in symbol XP_60_SHLD_Pin_Open, part A) Конт.
- (in symbol XP_60_SHLD_Pin_Open, part B) Конт.

### Library data of the parts
C115 = Non Polar Ver.: 0402 X7R 1 мкФ ±10 % 25 В; TemperatureRange: -XX...+XX°C; Manufacturer: *; PartNumber: *; Package: *; HelpURL: *; Tolerance: *; TypeDielectric: *; ESR: *; ComponentType: CAP; VoltageRating: *
C116-C119 = Non Polar Ver.: 0402 X7R 0,1 мкФ ±10 % 50 В; TemperatureRange: -XX...+XX°C; Manufacturer: *; PartNumber: *; Package: *; HelpURL: *; Tolerance: *; TypeDielectric: *; ESR: *; ComponentType: CAP; VoltageRating: *
C120 C123 = Non Polar Ver.: as C4 on sheet Э3-1 УВ ЦАП; Manufacturer: *; Package: *; HelpURL: *; Tolerance: *; TypeDielectric: *; ESR: *; ComponentType: CAP
C121 C122 = Non Polar Ver.: as C1 on sheet Э3-1 УВ ЦАП; Manufacturer: *; Package: *; HelpURL: *; Tolerance: *; TypeDielectric: *; ESR: *; ComponentType: CAP
DA5 = MCP1501-XXE/SN: High Precision Buffered Voltage Reference; TemperatureRange: -40...+125°C; Manufacturer: High Precision Buffered Voltage Reference; Package: 8-SOIC; PartNumber: MCP1501-33E/SN; ComponentType: IC; DatasheetURL: *; HelpURL: *; PinCount: 8
DA6 = OPA4317: Zerø-Drift, Low-Offset, Rail-to-Rail I/O Operational Amplifier; Manufacturer: Texas Instruments; TemperatureRange: -40...+125°C; Package: 14-SOIC; PartNumber: OPA4317IDR; ComponentType: IC; DatasheetURL: *; HelpURL: *; PinCount: 14
L25 L26 = Inductor MC Hor.: as L1 on sheet Э3-1 УВ ЦАП; Manufacturer: *; Package: *; HelpURL: *; MaxCurrent: *; ComponentType: IND; DatasheetURL: *; PinCount: 2
R74 = Resistor Hor.: TemperatureRange: -XX...+XX°C; Manufacturer: *; PartNumber: *; Package: *; HelpURL: *; PowerRating: *; Tolerance: *; DatasheetURL: *; ComponentType: RES
R75 = Resistor Hor.: 0402 2,7 кОм ±1 %; TemperatureRange: -XX...+XX°C; Manufacturer: *; PartNumber: *; Package: *; HelpURL: *; PowerRating: *; Tolerance: *; DatasheetURL: *; ComponentType: RES
R76-R78 = Resistor Hor.: 0402 3 кОм ±1 %; TemperatureRange: -XX...+XX°C; Manufacturer: *; PartNumber: *; Package: *; HelpURL: *; PowerRating: *; Tolerance: *; DatasheetURL: *; ComponentType: RES
R79 = Resistor Ver.: 0402 1,2 кОм ±1 %; TemperatureRange: -XX...+XX°C; Manufacturer: *; PartNumber: *; Package: *; HelpURL: *; PowerRating: *; DatasheetURL: *; Tolerance: *; ComponentType: RES
R80 R81 = Resistor Ver.: 0402 910 Ом ±1 %; TemperatureRange: -XX...+XX°C; Manufacturer: *; PartNumber: *; Package: *; HelpURL: *; PowerRating: *; DatasheetURL: *; Tolerance: *; ComponentType: RES
R82 = Resistor Ver.: 0402 1,5 кОм ±1 %; TemperatureRange: -XX...+XX°C; Manufacturer: *; PartNumber: *; Package: *; HelpURL: *; PowerRating: *; DatasheetURL: *; Tolerance: *; ComponentType: RES
XP1 = XP_60_SHLD_Pin_Open: TemperatureRange: -XX...+XX°C; Manufacturer: *; Package: *; HelpURL: *; DatasheetURL: *; PartNumber: *; PinCount: 60; ComponentType: Connector

## Nets that join several sheets
3.3V: Э3-1 УВ ЦАП (6 pins), Э3-2 УВ Компаратор (13 pins), Э3-3 Внешний триггер (7 pins), Э3-4 TDR Делитель (L17.1 L18.1 L19.2 L20.2), Э3-5 TDR Генератор (17 pins)
5V: Э3-2 УВ Компаратор (L10.2), Э3-5 TDR Генератор (L22.2), Э3-6 Электропитание (L25.1 L26.2)
-5V: Э3-2 УВ Компаратор (C40.1 L12.2 R23.1), Э3-5 TDR Генератор (C97.1 L24.2 R61.1)
GND: Э3-1 УВ ЦАП (38 pins), Э3-2 УВ Компаратор (44 pins), Э3-3 Внешний триггер (24 pins), Э3-4 TDR Делитель (21 pins), Э3-5 TDR Генератор (45 pins), Э3-6 Электропитание (38 pins)
V_REF_COMP_1V: Э3-1 УВ ЦАП (C14.1 DA2.3 R10.1), Э3-6 Электропитание (DA6.1 DA6.2)
V_REF_DELAY_0.75V: Э3-1 УВ ЦАП (C13.1 DA1.3 R9.1), Э3-6 Электропитание (DA6.6 DA6.7)
V_REF_TDR_1.1V: Э3-5 TDR Генератор (C41.1 DA4.3 DA4.4), Э3-6 Электропитание (DA6.13 DA6.14)
V_REF_TR_XXV: Э3-3 Внешний триггер (R33.1), Э3-6 Электропитание (DA6.8 DA6.9)
3.3V_VCC_COMP_TRANS: Э3-2 УВ Компаратор (5 pins), Э3-3 Внешний триггер (10 pins)
DAC_COMP_CLK: Э3-1 УВ ЦАП (DD2.28), Э3-6 Электропитание (XP1.38)
DAC_COMP_OUT: Э3-1 УВ ЦАП (C28.1 R14.2), Э3-2 УВ Компаратор (DA3.3 DA3.4)
DAC_COMP_SLEEP: Э3-1 УВ ЦАП (DD2.15), Э3-6 Электропитание (XP1.44)
DAC_D0: Э3-1 УВ ЦАП (DD1.14 DD2.14), Э3-6 Электропитание (XP1.4)
DAC_D1: Э3-1 УВ ЦАП (DD1.13 DD2.13), Э3-6 Электропитание (XP1.6)
DAC_D2: Э3-1 УВ ЦАП (DD1.12 DD2.12), Э3-6 Электропитание (XP1.8)
DAC_D3: Э3-1 УВ ЦАП (DD1.11 DD2.11), Э3-6 Электропитание (XP1.10)
DAC_D4: Э3-1 УВ ЦАП (DD1.10 DD2.10), Э3-6 Электропитание (XP1.14)
DAC_D5: Э3-1 УВ ЦАП (DD1.9 DD2.9), Э3-6 Электропитание (XP1.16)
DAC_D6: Э3-1 УВ ЦАП (DD1.8 DD2.8), Э3-6 Электропитание (XP1.18)
DAC_D7: Э3-1 УВ ЦАП (DD1.7 DD2.7), Э3-6 Электропитание (XP1.20)
DAC_D8: Э3-1 УВ ЦАП (DD1.6 DD2.6), Э3-6 Электропитание (XP1.24)
DAC_D9: Э3-1 УВ ЦАП (DD1.5 DD2.5), Э3-6 Электропитание (XP1.26)
DAC_D10: Э3-1 УВ ЦАП (DD1.4 DD2.4), Э3-6 Электропитание (XP1.28)
DAC_D11: Э3-1 УВ ЦАП (DD1.3 DD2.3), Э3-6 Электропитание (XP1.30)
DAC_D12: Э3-1 УВ ЦАП (DD1.2 DD2.2), Э3-6 Электропитание (XP1.34)
DAC_D13: Э3-1 УВ ЦАП (DD1.1 DD2.1), Э3-6 Электропитание (XP1.36)
DAC_DELAY_CLK: Э3-1 УВ ЦАП (DD1.28), Э3-6 Электропитание (XP1.40)
DAC_DELAY_OUT: Э3-1 УВ ЦАП (C27.1 R13.2), Э3-2 УВ Компаратор (DD3.17)
DAC_DELAY_SLEEP: Э3-1 УВ ЦАП (DD1.15), Э3-6 Электропитание (XP1.46)
DELAY_CLK_N: Э3-2 УВ Компаратор (DD3.5 R17.2 R18.1), Э3-3 Внешний триггер (DD7.6)
DELAY_CLK_P: Э3-2 УВ Компаратор (DD3.4 R15.2 R16.1), Э3-3 Внешний триггер (DD7.7)
DELAY_COMP_LEN: Э3-2 УВ Компаратор (DD3.10), Э3-6 Электропитание (XP1.39)
DELAY_COMP_nEN: Э3-2 УВ Компаратор (DD3.16), Э3-6 Электропитание (XP1.13)
DELAY_COMP_SETMAX: Э3-2 УВ Компаратор (DD3.12), Э3-6 Электропитание (XP1.15)
DELAY_COMP_SETMIN: Э3-2 УВ Компаратор (DD3.11), Э3-6 Электропитание (XP1.17)
DELAY_D0: Э3-2 УВ Компаратор (DD3.23), Э3-5 TDR Генератор (DD11.23), Э3-6 Электропитание (XP1.19)
DELAY_D1: Э3-2 УВ Компаратор (DD3.25), Э3-5 TDR Генератор (DD11.25), Э3-6 Электропитание (XP1.23)
DELAY_D2: Э3-2 УВ Компаратор (DD3.26), Э3-5 TDR Генератор (DD11.26), Э3-6 Электропитание (XP1.25)
DELAY_D3: Э3-2 УВ Компаратор (DD3.27), Э3-5 TDR Генератор (DD11.27), Э3-6 Электропитание (XP1.27)
DELAY_D4: Э3-2 УВ Компаратор (DD3.29), Э3-5 TDR Генератор (DD11.29), Э3-6 Электропитание (XP1.29)
DELAY_D5: Э3-2 УВ Компаратор (DD3.30), Э3-5 TDR Генератор (DD11.30), Э3-6 Электропитание (XP1.33)
DELAY_D6: Э3-2 УВ Компаратор (DD3.31), Э3-5 TDR Генератор (DD11.31), Э3-6 Электропитание (XP1.35)
DELAY_D7: Э3-2 УВ Компаратор (DD3.32), Э3-5 TDR Генератор (DD11.32), Э3-6 Электропитание (XP1.37)
DELAY_D8: Э3-2 УВ Компаратор (DD3.1), Э3-5 TDR Генератор (DD11.1), Э3-6 Электропитание (XP1.43)
DELAY_D9: Э3-2 УВ Компаратор (DD3.2), Э3-5 TDR Генератор (DD11.2), Э3-6 Электропитание (XP1.45)
DELAY_D10: Э3-2 УВ Компаратор (DD3.3), Э3-5 TDR Генератор (DD11.3), Э3-6 Электропитание (XP1.47)
DELAY_TDR_CLK_N: Э3-4 TDR Делитель (DD10.6), Э3-5 TDR Генератор (DD11.5 R54.2 R55.1)
DELAY_TDR_CLK_P: Э3-4 TDR Делитель (DD10.7), Э3-5 TDR Генератор (DD11.4 R52.2 R53.1)
DELAY_TDR_LEN: Э3-5 TDR Генератор (DD11.10), Э3-6 Электропитание (XP1.5)
DELAY_TDR_nEN: Э3-5 TDR Генератор (DD11.16), Э3-6 Электропитание (XP1.9)
DELAY_TDR_SETMAX: Э3-5 TDR Генератор (DD11.12), Э3-6 Электропитание (XP1.7)
DELAY_TDR_SETMIN: Э3-5 TDR Генератор (DD11.11), Э3-6 Электропитание (XP1.3)
TDR2_N: Э3-3 Внешний триггер (DD5.7 R39.2), Э3-4 TDR Делитель (DD8.14)
TDR2_P: Э3-3 Внешний триггер (DD5.6 R39.1), Э3-4 TDR Делитель (DD8.13)
TDR_P_STUB: Э3-2 УВ Компаратор (R20.2), Э3-5 TDR Генератор (R69.2)